# Altium project ATmega324PB_Xplained_Pro.PrjPCB (part 1 of 2)
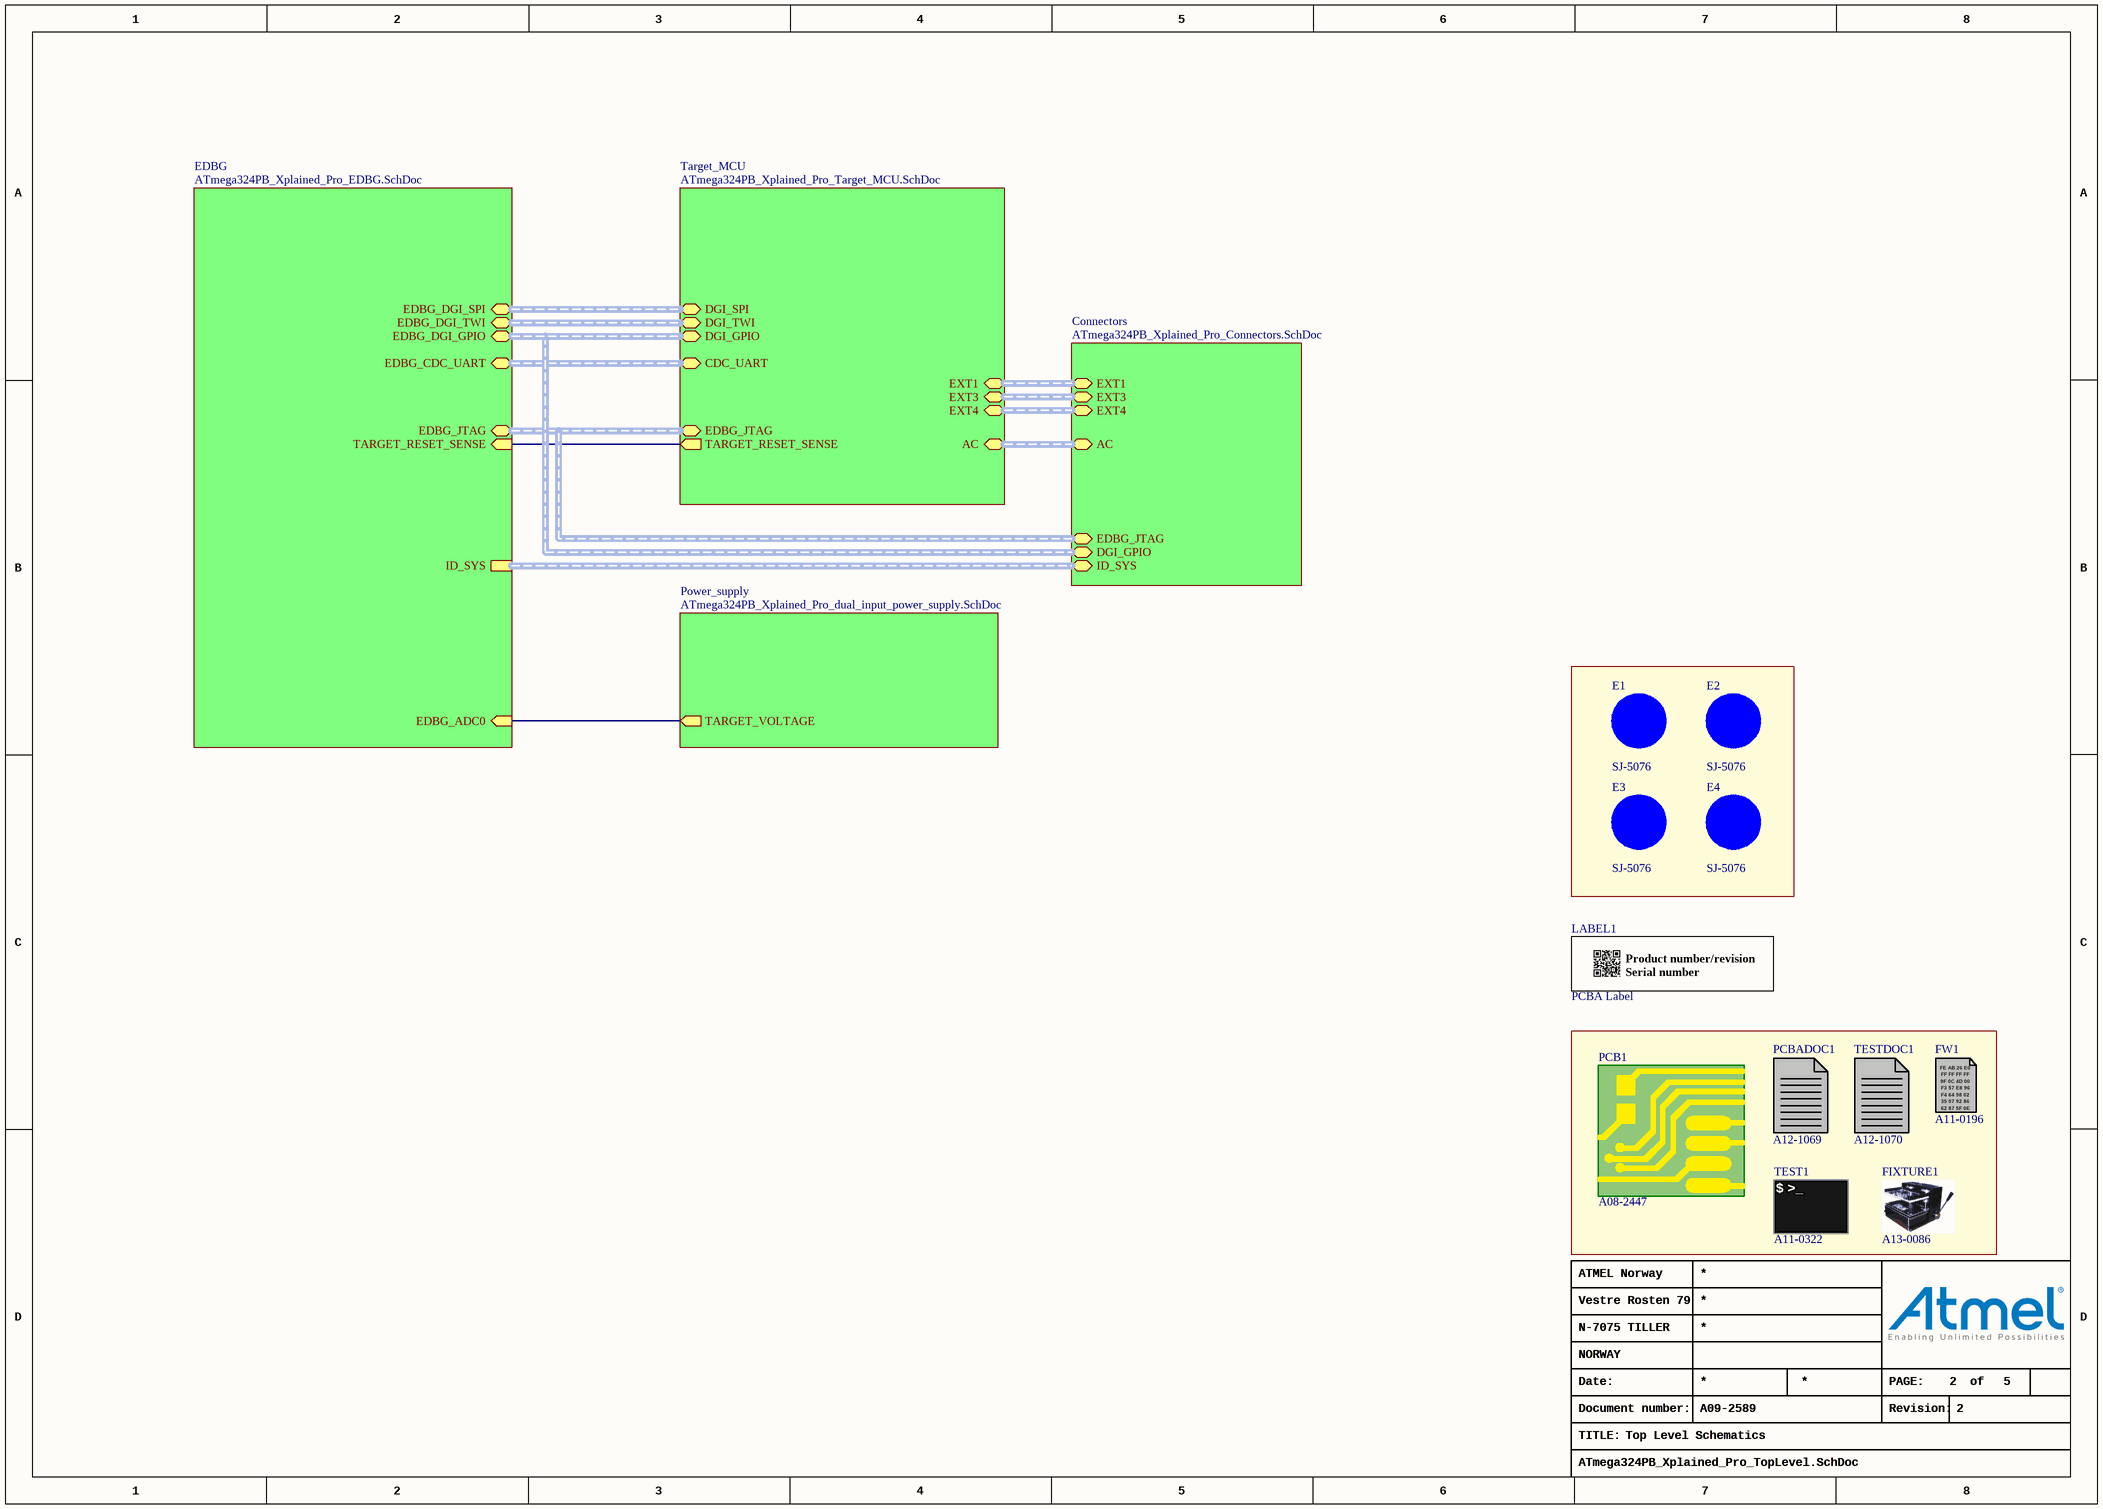
[diagram p0: ATmega324PB_Xplained_Pro_TopLevel.SchDoc]
5 sheets, 135 parts. Net scope: hierarchical (ports join the sheet entries above them; power ports are global).
Board file: ATmega324PB_Xplained_Pro.PcbDoc
Sheets:
  ATmega324PB_Xplained_Pro_TopLevel.SchDoc
    Target_MCU = ATmega324PB_Xplained_Pro_Target_MCU.SchDoc
    EDBG = ATmega324PB_Xplained_Pro_EDBG.SchDoc
    Connectors = ATmega324PB_Xplained_Pro_Connectors.SchDoc
    Power_supply = ATmega324PB_Xplained_Pro_dual_input_power_supply.SchDoc

## Sheet ATmega324PB_Xplained_Pro_TopLevel.SchDoc: Top Level Schematics
size A3; Organization: ATMEL Norway; Address1: Vestre Rosten 79; Address2: N-7075 TILLER; Address3: NORWAY; DocumentNumber: A09-2589; Revision: 2; SheetNumber: 2; SheetTotal: 5; PageSetup: Record=PageOptions|CenterHorizontal=True|CenterVertical=True|PrintScale=1.01|XCorrection=1.00|YCorrection=1.00|PrintKind=1|BorderSize=5000000|LeftOffset=0|BottomOffset=0|Orientation=2|PaperLength=1000|PaperWidth=1000|Scale=100|PaperSource=7|PrintQuality=-4|MediaType=1|DitherType=10|PaperKind=Letter|PrintScaleMode=1

### Parts
E1  value SJ-5076  [AP8-00192]
E2  value SJ-5076  [AP8-00192]
E3  value SJ-5076  [AP8-00192]
E4  value SJ-5076  [AP8-00192]
FIXTURE1  AN: A13-0086  (mechanical)
FW1  AN: A11-0196  (mechanical)
LABEL1  value PCBA Label  [AP8-00317]
PCB1  AN: A08-2447  (mechanical)
PCBADOC1  AN: A12-1069  (mechanical)
TEST1  AN: A11-0322  (mechanical)
TESTDOC1  AN: A12-1070  (mechanical)

### Sub-sheets
Connectors = ATmega324PB_Xplained_Pro_Connectors.SchDoc: ID_SYS (harness ID_SYS), EXT1 (harness EXT), EXT3 (harness EXT), EXT4 (harness EXT), DGI_GPIO (harness DGI_GPIO), AC (harness AC), EDBG_JTAG (harness JTAG)
EDBG = ATmega324PB_Xplained_Pro_EDBG.SchDoc: ID_SYS (harness ID_SYS), EDBG_CDC_UART (harness CDC_UART), EDBG_DGI_TWI (harness DGI_TWI), EDBG_DGI_SPI (harness DGI_SPI), EDBG_DGI_GPIO (harness DGI_GPIO), TARGET_RESET_SENSE (in), EDBG_ADC0 (in), EDBG_JTAG (harness JTAG)
Power_supply = ATmega324PB_Xplained_Pro_dual_input_power_supply.SchDoc: TARGET_VOLTAGE (out)
Target_MCU = ATmega324PB_Xplained_Pro_Target_MCU.SchDoc: DGI_SPI (harness DGI_SPI), DGI_TWI (harness DGI_TWI), DGI_GPIO (harness DGI_GPIO), CDC_UART (harness CDC_UART), TARGET_RESET_SENSE (out), EXT1 (harness EXT), EXT3 (harness EXT), EXT4 (harness EXT), AC (harness AC), EDBG_JTAG (harness JTAG)

### Nets
EDBG_ADC0: sheet EDBG/EDBG_ADC0, sheet Power_supply/TARGET_VOLTAGE
TARGET_RESET_SENSE: sheet Target_MCU/TARGET_RESET_SENSE, sheet EDBG/TARGET_RESET_SENSE

Not connected (* = marked no-connect by the designer): E1 1(FIDUCIAL); E2 1(FIDUCIAL); E3 1(FIDUCIAL); E4 1(FIDUCIAL)

### Buses and harness runs
harness sheet Connectors/AC = sheet Target_MCU/AC
harness sheet Connectors/DGI_GPIO = sheet EDBG/EDBG_DGI_GPIO = sheet Target_MCU/DGI_GPIO
harness sheet Connectors/EDBG_JTAG = sheet EDBG/EDBG_JTAG = sheet Target_MCU/EDBG_JTAG
harness sheet Connectors/EXT1 = sheet Target_MCU/EXT1
harness sheet Connectors/EXT3 = sheet Target_MCU/EXT3
harness sheet Connectors/EXT4 = sheet Target_MCU/EXT4
harness sheet Connectors/ID_SYS = sheet EDBG/ID_SYS
harness sheet EDBG/EDBG_CDC_UART = sheet Target_MCU/CDC_UART
harness sheet EDBG/EDBG_DGI_SPI = sheet Target_MCU/DGI_SPI
harness sheet EDBG/EDBG_DGI_TWI = sheet Target_MCU/DGI_TWI

### Notes on the sheet
- Date:
- PAGE:
- of
- TITLE:
- Document number:
- Revision:
- (in symbol A09-0611) / Product number/revision / Serial number
- (in symbol A11-0196) FE AB 26 E0; FF FF FF FF; 9F 0C 4D 00; F3 57 E8 96; F4 64 98 02; 35 07 92 86; 62 87 5F 0E
- (in symbol A11-0322) $ >_

### Library data of the parts
E1-E4 = A08-0053: 2.8mm adhesive feet,diam 8.0mm; PartGroup: Mechanical devices,Mounting accessories; Manufacturer: 3M; AN: A08-0053; Height: 2,79999995231628; MPN: SJ-5076
FIXTURE1 = A13-0086: Xplained PRO MCU board Jupiter Test Fixture; PartGroup: Test Equipment,Test Fixtures; Manufacturer: ESCATEC; Value: Xplained PRO MCU board Jupiter Test Fixture; MPN: Xplained PRO MCU board Jupiter Test Fixture
FW1 = A11-0196: EDBG secured firmware; PartGroup: Software,Firmware,Tools; Value: EDBG secured firmware
LABEL1 = A09-0611: PCBA identification label PP Top White Gloss; PartGroup: Mechanical devices,Packaging materials,Printed Labels; Manufacturer: ACT Logimark AS; MPN: 505462; AN: A09-0611
PCB1 = A08-2447: ATmega324PB_Xplained_Pro PCB documentation; PartGroup: Mechanical devices; Value: ATmega324PB_Xplained_Pro PCB documentation
PCBADOC1 = A12-1069: ATmega324PB Xplained Pro PCBA documentation; PartGroup: Documentation,PCBA Documents,Atmel; Value: A09-2589 PCBA Files
TEST1 = A11-0322: Fixture test for ATmega324PB Xplained Pro; PartGroup: Software,Test software,Starter Kit; Value: ATmega324PB Xplained Pro test
TESTDOC1 = A12-1070: ATmega324PB Xplained Pro Test Instructions; PartGroup: Documentation,Procedures,Test Instructions; Value: ATmega324PB Xplained Pro Test Instructions

## Sheet ATmega324PB_Xplained_Pro_Target_MCU.SchDoc: Target MCU
size A3; Organization: ATMEL Norway; Address1: Vestre Rosten 79; Address2: N-7075 TILLER; Address3: NORWAY; DocumentNumber: A09-2589; Revision: 2; SheetNumber: 3; SheetTotal: 5; PageSetup: Record=PageOptions|CenterHorizontal=True|CenterVertical=True|PrintScale=1.01|XCorrection=1.00|YCorrection=1.00|PrintKind=1|BorderSize=5000000|LeftOffset=0|BottomOffset=0|Orientation=2|PaperLength=1000|PaperWidth=1000|Scale=100|PaperSource=7|PrintQuality=-4|MediaType=1|DitherType=10|PaperKind=A3 (297 x 420 mm)|PrintScaleMode=1
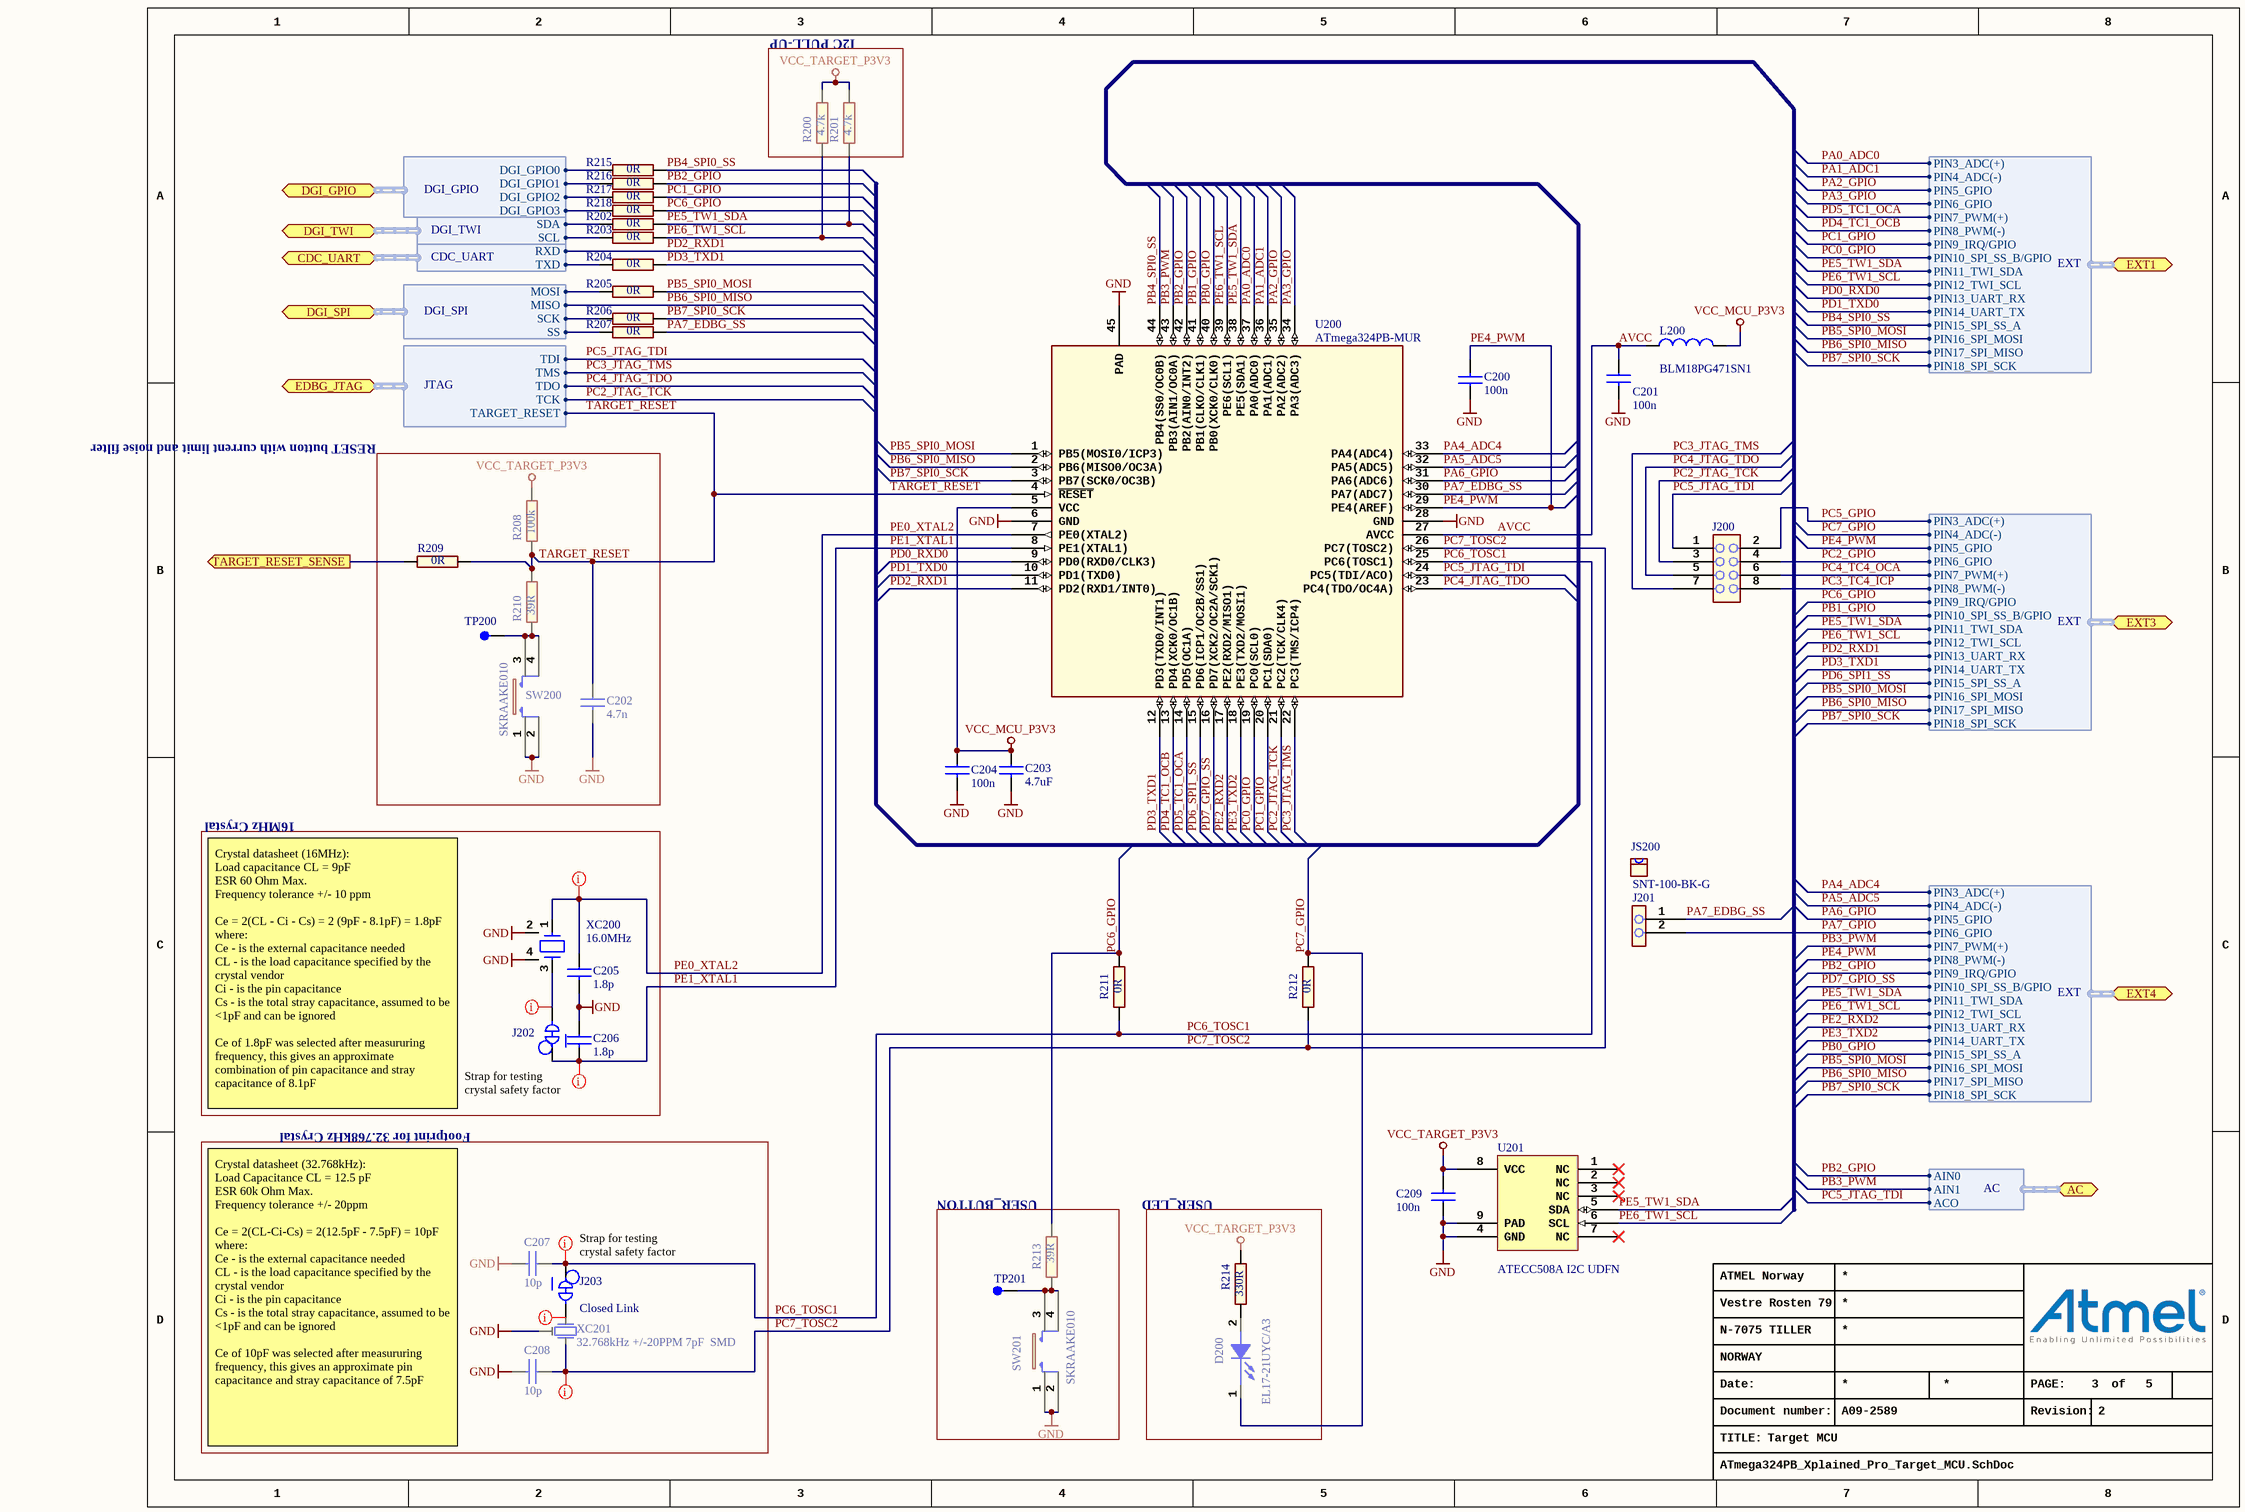
[diagram p1: ATmega324PB_Xplained_Pro_Target_MCU.SchDoc]

### Parts
C200  value 100n  [AP1-00001]
C201  value 100n  [AP1-00001]
C202  value 4.7n  [AP1-00053]
C203  value 4.7uF  [AP1-00039]
C204  value 100n  [AP1-00001]
C205  value 1.8p  [AP1-00001]
C206  value 1.8p  [AP1-00001]
C207  value 10p  [AP1-00001]
C208  value 10p  [AP1-00001]
C209  value 100n  [AP1-00001]
D200  value EL17-21UYC/A3  [AP4-00013]
J200  (no value)  [AP8-00971]
J201  (no value)  [AP8-00733]
J202  (no value)  [AP8-00595]  (net tie, no BOM)
J203  value Closed Link  [AP8-00595]  (net tie, no BOM)
JS200  value SNT-100-BK-G  [AP8-00525]
L200  value BLM18PG471SN1  [AP3-00005]
R200  value 4.7k  [AP2-00000]
R201  value 4.7k  [AP2-00000]
R202  value 0R  [AP2-00000]
R203  value 0R  [AP2-00000]
R204  value 0R  [AP2-00000]
R205  value 0R  [AP2-00000]
R206  value 0R  [AP2-00000]
R207  value 0R  [AP2-00000]
R208  value 100k  [AP2-00011]
R209  value 0R  [AP2-00000]
R210  value 39R  [AP2-00011]
R211  value 0R  [AP2-00000]
R212  value 0R  [AP2-00000]
R213  value 39R  [AP2-00011]
R214  value 330R  [AP2-00000]
R215  value 0R  [AP2-00000]
R216  value 0R  [AP2-00000]
R217  value 0R  [AP2-00000]
R218  value 0R  [AP2-00000]
SW200  value SKRAAKE010  [AP8-00137]  (hidden comment: Can be ordered in low volumes from Mouser)
SW201  value SKRAAKE010  [AP8-00137]  (hidden comment: Can be ordered in low volumes from Mouser)
TP200  (no value)  [AP8-00010]  (no BOM)
TP201  (no value)  [AP8-00010]  (no BOM)
U200  value ATmega324PB-MUR  [AP6-00147]  (hidden comment: Footprint has tight silkscreen to solder mask expansion clearance)
U201  value ATECC508A I2C UDFN  [AP6-00409]
XC200  value 16.0MHz  [AP7-00061]
XC201  value 32.768kHz +/-20PPM 7pF  SMD  [AP7-00044]  (hidden comment: Farnell order no:1539364)

### Blocks framed on the sheet
I2C PULL-UP: R200 R201
RESET button with current limit and noise filter: C202 R208-R210 SW200 TP200
16MHz Crystal: C205 C206 J202 XC200
Footprint for 32.768kHz Crystal: C207 C208 J203 XC201
USER_BUTTON: R213 SW201 TP201
USER_LED: D200 R214

### Ports
AC (harness AC), CDC_UART (harness CDC_UART), DGI_GPIO (harness DGI_GPIO), DGI_SPI (harness DGI_SPI), DGI_TWI (harness DGI_TWI), EDBG_JTAG (harness JTAG), EXT1 (harness EXT), EXT3 (harness EXT), EXT4 (harness EXT), TARGET_RESET_SENSE (out)

### Harnesses
DGI_GPIO: DGI_GPIO0, DGI_GPIO1, DGI_GPIO2, DGI_GPIO3
DGI_SPI: MISO, MOSI, SCK, SS
DGI_TWI: SCL, SDA
CDC_UART: RXD, TXD
EXT: PIN10_SPI_SS_B/GPIO, PIN11_TWI_SDA, PIN12_TWI_SCL, PIN13_UART_RX, PIN14_UART_TX, PIN15_SPI_SS_A, PIN16_SPI_MOSI, PIN17_SPI_MISO, PIN18_SPI_SCK, PIN3_ADC(+), PIN4_ADC(-), PIN5_GPIO, PIN6_GPIO, PIN7_PWM(+), PIN8_PWM(-), PIN9_IRQ/GPIO
JTAG: TCK, TDI, TDO, TMS, TARGET_RESET
AC: AIN1, AIN0, ACO

### Nets
GND: C200.1 C201.2 C202.2 C203.2 C204.2 C205.2 C206.1 C207.2 C208.2 C209.1 SW200.1 SW200.2 SW201.1 SW201.2 U200.6(GND) U200.28(GND) U200.45(PAD) U201.4(GND) U201.9(PAD) XC200.2(GND) XC200.4(GND) XC201.3
VCC_MCU_P3V3: C203.1 C204.1 L200.2 U200.5(VCC)
VCC_TARGET_P3V3: C209.2 R200.2 R201.2 R208.2 R214.2 U201.8(VCC)
AVCC: C201.1 L200.1 U200.27(AVCC)
DGI_GPIO0_CL: R215.1 ; port DGI_GPIO.DGI_GPIO0
DGI_GPIO1_CL: R216.1 ; port DGI_GPIO.DGI_GPIO1
DGI_GPIO2_CL: R217.1 ; port DGI_GPIO.DGI_GPIO2
DGI_GPIO3_CL: R218.1 ; port DGI_GPIO.DGI_GPIO3
EDBG_CDC_USART_RX: R204.1 ; port CDC_UART.TXD
EDBG_DGI_SCL: R203.1 ; port DGI_TWI.SCL
EDBG_DGI_SDA: R202.1 ; port DGI_TWI.SDA
EDBG_SPI_DGI_MOSI: R205.1 ; port DGI_SPI.MOSI
EDBG_SPI_DGI_SCK: R206.1 ; port DGI_SPI.SCK
EDBG_SPI_DGI_SS: R207.1 ; port DGI_SPI.SS
PA0_ADC0: U200.37(PA0(ADC0)) ; port EXT1.PIN3_ADC(+)
PA1_ADC1: U200.36(PA1(ADC1)) ; port EXT1.PIN4_ADC(-)
PA2_GPIO: U200.35(PA2(ADC2)) ; port EXT1.PIN5_GPIO
PA3_GPIO: U200.34(PA3(ADC3)) ; port EXT1.PIN6_GPIO
PA4_ADC4: U200.33(PA4(ADC4)) ; port EXT4.PIN3_ADC(+)
PA5_ADC5: U200.32(PA5(ADC5)) ; port EXT4.PIN4_ADC(-)
PA6_GPIO: U200.31(PA6(ADC6)) ; port EXT4.PIN5_GPIO
PA7_EDBG_SS: J201.1 R207.2 U200.30(PA7(ADC7))
PA7_GPIO: J201.2 ; port EXT4.PIN6_GPIO
PB0_GPIO: U200.40(PB0(XCK0/CLK0)) ; port EXT4.PIN15_SPI_SS_A
PB1_GPIO: U200.41(PB1(CLKO/CLK1)) ; port EXT3.PIN10_SPI_SS_B/GPIO
PB2_GPIO: R216.2 U200.42(PB2(AIN0/INT2)) ; port EXT4.PIN9_IRQ/GPIO, port AC.AIN0
PB3_PWM: U200.43(PB3(AIN1/OC0A)) ; port EXT4.PIN7_PWM(+), port AC.AIN1
PB4_SPI0_SS: R215.2 U200.44(PB4(SS0/OC0B)) ; port EXT1.PIN15_SPI_SS_A
PB5_SPI0_MOSI: R205.2 U200.1(PB5(MOSI0/ICP3)) ; port EXT1.PIN16_SPI_MOSI, port EXT4.PIN16_SPI_MOSI, port EXT3.PIN16_SPI_MOSI
PB6_SPI0_MISO: U200.2(PB6(MISO0/OC3A)) ; port DGI_SPI.MISO, port EXT1.PIN17_SPI_MISO, port EXT4.PIN17_SPI_MISO, port EXT3.PIN17_SPI_MISO
PB7_SPI0_SCK: R206.2 U200.3(PB7(SCK0/OC3B)) ; port EXT1.PIN18_SPI_SCK, port EXT4.PIN18_SPI_SCK, port EXT3.PIN18_SPI_SCK
PC0_GPIO: U200.19(PC0(SCL0)) ; port EXT1.PIN10_SPI_SS_B/GPIO
PC1_GPIO: R217.2 U200.20(PC1(SDA0)) ; port EXT1.PIN9_IRQ/GPIO
PC2_GPIO: J200.4 ; port EXT3.PIN6_GPIO
PC2_JTAG_TCK: J200.3 U200.21(PC2(TCK/CLK4)) ; port EDBG_JTAG.TCK
PC3_JTAG_TMS: J200.7 U200.22(PC3(TMS/ICP4)) ; port EDBG_JTAG.TMS
PC3_TC4_ICP: J200.8 ; port EXT3.PIN8_PWM(-)
PC4_JTAG_TDO: J200.5 U200.23(PC4(TDO/OC4A)) ; port EDBG_JTAG.TDO
PC4_TC4_OCA: J200.6 ; port EXT3.PIN7_PWM(+)
PC5_GPIO: J200.2 ; port EXT3.PIN3_ADC(+)
PC5_JTAG_TDI: J200.1 U200.24(PC5(TDI/ACO)) ; port EDBG_JTAG.TDI, port AC.ACO
PC6_GPIO: R211.2 R213.2 R218.2 ; port EXT3.PIN9_IRQ/GPIO
PC6_TOSC1: C207.1 J203.1 R211.1 U200.25(PC6(TOSC1))
PC7_GPIO: D200.1(CATHODE) R212.2 ; port EXT3.PIN4_ADC(-)
PC7_TOSC2: C208.1 R212.1 U200.26(PC7(TOSC2)) XC201.1
PD0_RXD0: U200.9(PD0(RXD0/CLK3)) ; port EXT1.PIN13_UART_RX
PD1_TXD0: U200.10(PD1(TXD0)) ; port EXT1.PIN14_UART_TX
PD2_RXD1: U200.11(PD2(RXD1/INT0)) ; port CDC_UART.RXD, port EXT3.PIN13_UART_RX
PD3_TXD1: R204.2 U200.12(PD3(TXD0/INT1)) ; port EXT3.PIN14_UART_TX
PD4_TC1_OCB: U200.13(PD4(XCK0/OC1B)) ; port EXT1.PIN8_PWM(-)
PD5_TC1_OCA: U200.14(PD5(OC1A)) ; port EXT1.PIN7_PWM(+)
PD6_SPI1_SS: U200.15(PD6(ICP1/OC2B/SS1)) ; port EXT3.PIN15_SPI_SS_A
PD7_GPIO_SS: U200.16(PD7(XCK2/OC2A/SCK1)) ; port EXT4.PIN10_SPI_SS_B/GPIO
PE0_XTAL2: C205.1 U200.7(PE0(XTAL2)) XC200.1(IN)
PE1_XTAL1: C206.2 J202.1 U200.8(PE1(XTAL1))
PE2_RXD2: U200.17(PE2(RXD2/MISO1)) ; port EXT4.PIN13_UART_RX
PE3_TXD2: U200.18(PE3(TXD2/MOSI1)) ; port EXT4.PIN14_UART_TX
PE4_PWM: C200.2 U200.29(PE4(AREF)) ; port EXT4.PIN8_PWM(-), port EXT3.PIN5_GPIO
PE5_TW1_SDA: R201.1 R202.2 U200.38(PE5(SDA1)) U201.5(SDA) ; port EXT1.PIN11_TWI_SDA, port EXT4.PIN11_TWI_SDA, port EXT3.PIN11_TWI_SDA
PE6_TW1_SCL: R200.1 R203.2 U200.39(PE6(SCL1)) U201.6(SCL) ; port EXT1.PIN12_TWI_SCL, port EXT4.PIN12_TWI_SCL, port EXT3.PIN12_TWI_SCL
TARGET_RESET: C202.1 R208.1 R209.2 R210.2 U200.4(~{RESET}) ; port EDBG_JTAG.TARGET_RESET
TARGET_RESET_SENSE: R209.1 ; port TARGET_RESET_SENSE
NetD200_2: D200.2(ANODE) R214.1
NetJ202_2: J202.2 XC200.3(OUT)
NetJ203_2: J203.2 XC201.2
NetR210_1: R210.1 SW200.3 SW200.4 TP200.1
NetR213_1: R213.1 SW201.3 SW201.4 TP201.1

Not connected (* = marked no-connect by the designer): U201 1(NC)* 2(NC)* 3(NC)* 7(NC)*

### Layout directives
rule Assembly Testpoint Usage [Testpoint - Not Allowed    Multiple - Not Allowed]: NetJ202_2, NetJ203_2, PC6_TOSC1, PC7_TOSC2, PE0_XTAL2, PE1_XTAL1

### Notes on the sheet
- Crystal datasheet (16MHz):
  Load capacitance CL = 9pF
  ESR 60 Ohm Max.
  Frequency tolerance +/- 10 ppm
  Ce = 2(CL - Ci - Cs) = 2 (9pF - 8.1pF) = 1.8pF
  where:
  Ce - is the external capacitance needed
  CL - is the load capacitance specified by the crystal vendor
  Ci - is the pin capacitance
  Cs - is the total stray capacitance, assumed to be <1pF and can be ignored
  Ce of 1.8pF was selected after measururing frequency, this gives an approximate combination of pin capacitance and stray capacitance of 8.1pF
- Strap for testing crystal safety factor
- (near J203) Strap for testing crystal safety factor
- Crystal datasheet (32.768kHz):
  Load Capacitance CL = 12.5 pF
  ESR 60k Ohm Max.
  Frequency tolerance +/- 20ppm
  Ce = 2(CL-Ci-Cs) = 2(12.5pF - 7.5pF) = 10pF
  where:
  Ce - is the external capacitance needed
  CL - is the load capacitance specified by the crystal vendor
  Ci - is the pin capacitance
  Cs - is the total stray capacitance, assumed to be <1pF and can be ignored
  Ce of 10pF was selected after measururing frequency, this gives an approximate pin capacitance and stray capacitance of 7.5pF
- Date:
- PAGE:
- of
- TITLE:
- Document number:
- Revision:

### Library data of the parts
C200 C201 C204 C209 = A01-0246: Ceramic capacitor, SMD 0402, X7R, 16V, +/-10%; PartGroup: Capacitors,Ceramic,SMD 0402; Manufacturer: Kemet; MPN: C0402C104K4RACTU; TemperatureRange: -55 - +125 deg C; AN: A01-0246; Tolerance: 16V, +/-10%; Height: 0,5
C202 = A01-0046: Ceramic capacitor, SMD 0402, X7R, 25V, +/-10% (de35287); PartGroup: Capacitors,Ceramic,SMD 0402; TemperatureRange: -55 - +125 deg C; AN: A01-0046; Height: 0,550000011920929; Tolerance: 25V, +/-10%
C203 = A01-0377: Ceramic capacitor, SMD 0603, X5R, 10V, 10% (de31036); PartGroup: Capacitors,Ceramic,SMD 0603; Manufacturer: tdk; MPN: C1608X5R1A475K; TemperatureRange: -55 - +85 deg C; AN: A01-0377; Tolerance: 10%; Height: 0,800000011920929
C205 C206 = A01-0006: Ceramic capacitor, SMD 0402, NP0, 50V, +/-0.25pF; PartGroup: Capacitors,Ceramic,SMD 0402; TemperatureRange: -55 - +125 deg C; AN: A01-0006; Tolerance: 50V, +/-0.25pF; Height: 0,550000011920929
C207 C208 = A01-0015: Ceramic capacitor, SMD 0402, NP0, 50V, +/-5%; PartGroup: Capacitors,Ceramic,SMD 0402; TemperatureRange: -55 - +125 deg C; AN: A01-0015; Tolerance: 50V, +/-5%; Height: 0,550000011920929
D200 = A10-0019: LED, Yellow, Wave length=591nm, SMD 0805, ±70°; PartGroup: Opto,LEDs,SMD; Manufacturer: Everlight; MPN: 17-21UYC/S530-A3/TR8; TemperatureRange: -40 to +85 deg C; AN: A10-0019; Height: 1,10000002384186
J200 = A08-2452: 2x4 pin header, 2.54 mm pitch, Pin-in-Paste THM; PartGroup: Mechanical devices,Connectors,Pin headers; Manufacturer: SAMTEC; Value: HMTSW-104-23-F-D-237; TemperatureRange: - 55 C to + 125 C; AN: A08-2452; Height: 6,09999990463257; MPN: HMTSW-104-23-F-D-237
J201 = A08-1754: 1x2 pin header, 2.54mm pitch, Pin-in-Paste THM; PartGroup: Mechanical devices,Connectors,Pin headers; Manufacturer: SAMTEC; Value: HMTSW-102-23-F-S-237; TemperatureRange: - 55 deg C to + 125 deg C; AN: A08-1754; Height: 6,09999990463257; MPN: HMTSW-102-23-F-S-237
J202 J203 = A08-1454: Closed Link 0402; PartGroup: Mechanical devices,PCB implemented components; AN: A08-1454
  J202: Value: Closed Link
JS200 = A08-0543: Jumper cap for 2.54mm pinheader; PartGroup: Mechanical devices,Mounting accessories,Other; Manufacturer: SAMTEC; AN: A08-0543; MPN: SNT-100-BK-G
L200 = A03-0035: SMD RF inductor 0603. Z=470Ohm (@100MHz), Max R(dc)=0.65Ohm, Max current=1A; PartGroup: Inductors,EMI; Manufacturer: Murata; Tolerance: ±25%; TemperatureRange: -55°C to +125°C; AN: A03-0035; Height: 0,800000011920929; MPN: BLM18PG471SN1
R200 R201 = A02-0228: Thick film resistor, SMD 0402, 1/16W, 1%; PartGroup: Resistors,SMD,0402 1%; TemperatureRange: -55ï¿½ to +125ï¿½C; AN: A02-0228; Tolerance: 1 %; Height: 0,349999994039536
R202-R207 R209 R211 R212 R215-R218 = A02-0163: RES 0.0 OHM 1/16W 0402 SMD; PartGroup: Resistors,SMD,0402 1%; Manufacturer: (n/a); MPN: RMCF0402ZT0R00; Tolerance: 1 %; TemperatureRange: -55 - +125 deg C; AN: A02-0163; Height: 0,349999994039536
R208 = A02-0260: Thick film resistor, SMD 0402, 1/16W, 1%; PartGroup: Resistors,SMD,0402 1%; TemperatureRange: -55ï¿½ to +125ï¿½C; AN: A02-0260; Tolerance: 1 %; Height: 0,349999994039536
R210 R213 = A02-0178: Thick film resistor, SMD 0402, 1/16W, 1%; PartGroup: Resistors,SMD,0402 1%; TemperatureRange: -55 - +125 deg C; AN: A02-0178; Tolerance: 1 %; Height: 0,349999994039536
R214 = A02-0200: Thick film resistor, SMD 0402, 1/16W, 1%; PartGroup: Resistors,SMD,0402 1%; TemperatureRange: -55 - +125 deg C; AN: A02-0200; Tolerance: 1 %; Height: 0,349999994039536
SW200 SW201 = A08-0790: 6.2x6.2 mm SMD tact switch, same as A08-0091 but less force is needed; PartGroup: Mechanical devices,Switches,SMD; Manufacturer: ALPS; TemperatureRange: -30 - +90 deg C; AN: A08-0790; Height: 5,09999990463257; MPN: SKRAAKE010
TP200 TP201 = A08-0004: Single SMD testpad; PartGroup: Mechanical devices,Connectors,Test points; AN: A08-0004; Value: TESTPAD; Height: 0
U200 = A06-1345: AVR 8-bit RISC MCU; PartGroup: Integrated Circuits,MCU, MPU, DSP,AVR MCU; Manufacturer: ATMEL; AN: A06-1345; MPN: ATmega324PB-MUR
U201 = A06-1281: ATECC508A with an I2C Interface and a 8 Pin UDFN Package with Paddle; PartGroup: Integrated Circuits,Special function,Encryption; Manufacturer: ATMEL; MPN: ATECC508A-MAHDA-T; AN: A06-1281; Height: 0,600000023841858
XC200 = A07-0078: 16MHz uXtal, 3.2 x 2.5 mm SMD, CL=9pF, 15PPM, ESR=80ohm(Max.; PartGroup: Frequency devices,Crystals,SMD; Manufacturer: Epson Toyocom; MPN: TSX-3225 16.0000MF09Z-AC3; TemperatureRange: -40Â°C to +85Â°C; AN: A07-0078; Tolerance: 15ppm; Height: 0,699999988079071
XC201 = A07-0052: 32k768 crystal, +-20ppm, CL=7pF, max ESR 60kOhm, SMD; PartGroup: Frequency devices,Crystals,SMD; Manufacturer: Micro Crystal; MPN: MS1V-T1K 32.768kHz 7pF +/-20PPM TA; Tolerance: +/- 20 PPM; TemperatureRange: -40 /+85; AN: A07-0052; Height: 2,07999992370605

## Sheet ATmega324PB_Xplained_Pro_EDBG.SchDoc: Embedded Debugger (EDBG)
size A3; Organization: ATMEL Norway; Address1: Vestre Rosten 79; Address2: N-7075 TILLER; Address3: NORWAY; DocumentNumber: A09-2589; Revision: 2; SheetNumber: 5; SheetTotal: 5; PageSetup: Record=PageOptions|CenterHorizontal=True|CenterVertical=True|PrintScale=0.73|XCorrection=1.00|YCorrection=1.00|PrintKind=1|BorderSize=5000000|LeftOffset=0|BottomOffset=0|Orientation=2|PaperLength=1000|PaperWidth=1000|Scale=100|PaperSource=7|PrintQuality=-4|MediaType=1|DitherType=10|PaperKind=A3 (297 x 420 mm)|PrintScaleMode=1
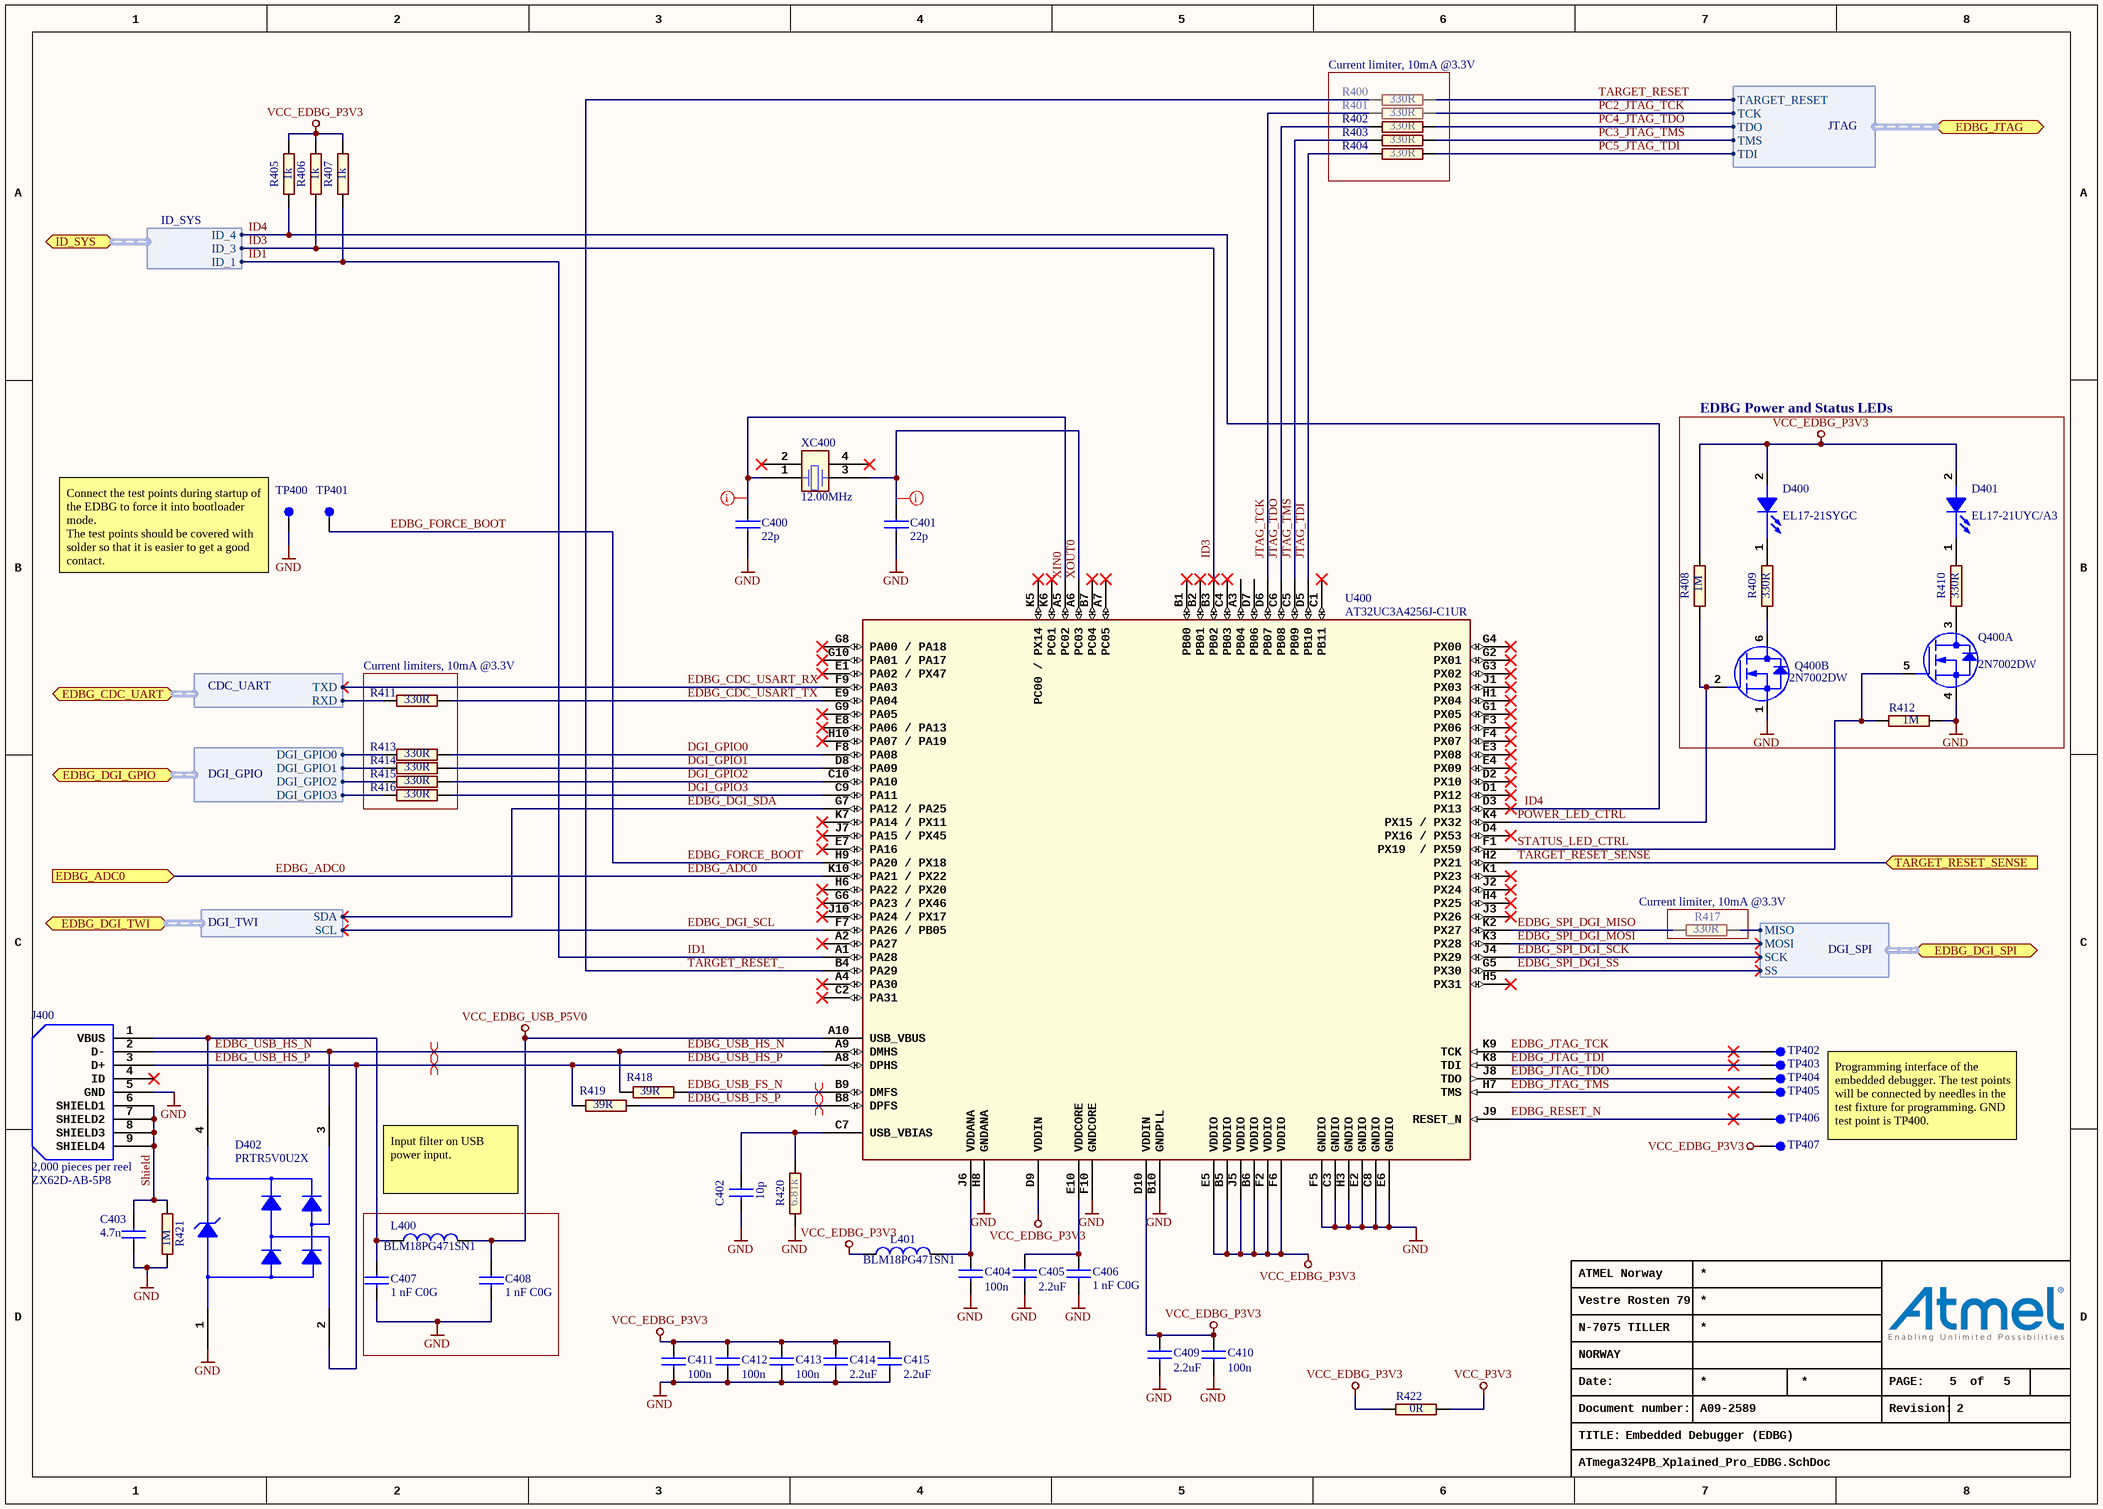
[diagram p2: ATmega324PB_Xplained_Pro_EDBG.SchDoc]

### Parts
C400  value 22p  [AP1-00053]
C401  value 22p  [AP1-00053]
C402  value 10p  [AP1-00053]
C403  value 4.7n  [AP1-00053]
C404  value 100n  [AP1-00053]
C405  value 2.2uF  [AP1-00053]  (hidden comment: Farnell no: 1288200)
C406  value 1 nF C0G  [AP1-00053]
C407  value 1 nF C0G  [AP1-00053]
C408  value 1 nF C0G  [AP1-00053]
C409  value 2.2uF  [AP1-00053]  (hidden comment: Farnell no: 1288200)
C410  value 100n  [AP1-00053]
C411  value 100n  [AP1-00053]
C412  value 100n  [AP1-00053]
C413  value 100n  [AP1-00053]
C414  value 2.2uF  [AP1-00053]  (hidden comment: Farnell no: 1288200)
C415  value 2.2uF  [AP1-00053]  (hidden comment: Farnell no: 1288200)
D400  value EL17-21SYGC  [AP4-00013]
D401  value EL17-21UYC/A3  [AP4-00013]
D402  value PRTR5V0U2X  [AP4-00001]  (hidden comment: Changed manufacturer from Philips to NXP.)
J400  2,000 pieces per reel  value ZX62D-AB-5P8  [AP8-00852]
L400  value BLM18PG471SN1  [AP3-00005]
L401  value BLM18PG471SN1  [AP3-00005]
Q400  value 2N7002DW  [AP5-00001]  (hidden comment: Same as 2N7002 but with two MOSFETs in one package)  (parts A,B of 2)
R400  value 330R  [AP2-00000]
R401  value 330R  [AP2-00000]
R402  value 330R  [AP2-00000]
R403  value 330R  [AP2-00000]
R404  value 330R  [AP2-00000]
R405  value 1k  [AP2-00000]
R406  value 1k  [AP2-00000]
R407  value 1k  [AP2-00000]
R408  value 1M  [AP2-00000]
R409  value 330R  [AP2-00000]
R410  value 330R  [AP2-00000]
R411  value 330R  [AP2-00000]
R412  value 1M  [AP2-00000]
R413  value 330R  [AP2-00000]
R414  value 330R  [AP2-00000]
R415  value 330R  [AP2-00000]
R416  value 330R  [AP2-00000]
R417  value 330R  [AP2-00000]
R418  value 39R  [AP2-00011]
R419  value 39R  [AP2-00011]
R420  value 6.81k  [AP2-00011]
R421  value 1M  [AP2-00011]
R422  value 0R  [AP2-00000]
TP400  (no value)  [AP8-00010]  (no BOM)
TP401  (no value)  [AP8-00010]  (no BOM)
TP402  (no value)  [AP8-00010]  (no BOM)
TP403  (no value)  [AP8-00010]  (no BOM)
TP404  (no value)  [AP8-00010]  (no BOM)
TP405  (no value)  [AP8-00010]  (no BOM)
TP406  (no value)  [AP8-00010]  (no BOM)
TP407  (no value)  [AP8-00010]  (no BOM)
U400  value AT32UC3A4256J-C1UR  [AP6-00206]  (hidden comment: 100 ball VFBGA)
XC400  value 12.00MHz  [AP7-00039]

### Blocks framed on the sheet
Current limiter, 10mA @3.3V: R400-R404
EDBG Power and Status LEDs: D400 D401 Q400 R408-R410 R412
Current limiters, 10mA @3.3V: R411 R413-R416

### Ports
EDBG_ADC0 (in), EDBG_CDC_UART (harness CDC_UART), EDBG_DGI_GPIO (harness DGI_GPIO), EDBG_DGI_SPI (harness DGI_SPI), EDBG_DGI_TWI (harness DGI_TWI), EDBG_JTAG (harness JTAG), ID_SYS (harness ID_SYS), TARGET_RESET_SENSE (in)

### Harnesses
CDC_UART: TXD, RXD
DGI_SPI: MISO, MOSI, SCK, SS
DGI_GPIO: DGI_GPIO0, DGI_GPIO1, DGI_GPIO2, DGI_GPIO3
DGI_TWI: SCL, SDA
JTAG: TCK, TDI, TDO, TMS, TARGET_RESET
ID_SYS: ID_1, ID_3, ID_4

### Nets
GND: C400.2 C401.2 C402.2 C403.1 C404.2 C405.2 C406.2 C407.2 C408.2 C409.2 C410.2 C411.2 C412.2 C413.2 C414.2 C415.2 D402.1(GND) J400.5(GND) Q400.1(S2) Q400.4(S1) R412.1 R420.1 R421.1 TP400.1 U400.B10(GNDPLL) U400.C3(GNDIO) U400.C8(GNDIO) U400.E2(GNDIO) U400.E6(GNDIO) U400.F5(GNDIO) U400.F10(GNDCORE) U400.H3(GNDIO) U400.H8(GNDANA)
VCC_EDBG_P3V3: C409.1 C410.1 C411.1 C412.1 C413.1 C414.1 C415.1 D400.2(ANODE) D401.2(ANODE) L401.1 R405.2 R406.2 R407.2 R408.2 R422.1 TP407.1 U400.B5(VDDIO) U400.B6(VDDIO) U400.D9(VDDIN) U400.D10(VDDIN) U400.E5(VDDIO) U400.F2(VDDIO) U400.F6(VDDIO) U400.J5(VDDIO)
VCC_EDBG_USB_P5V0: C408.1 L400.2 U400.A10(USB_VBUS)
VCC_P3V3: R422.2
DGI_GPIO0: R413.2 U400.F8(PA08)
DGI_GPIO0_CL: R413.1 ; port EDBG_DGI_GPIO.DGI_GPIO0
DGI_GPIO1: R414.2 U400.D8(PA09)
DGI_GPIO1_CL: R414.1 ; port EDBG_DGI_GPIO.DGI_GPIO1
DGI_GPIO2: R415.2 U400.C10(PA10)
DGI_GPIO2_CL: R415.1 ; port EDBG_DGI_GPIO.DGI_GPIO2
DGI_GPIO3: R416.2 U400.C9(PA11)
DGI_GPIO3_CL: R416.1 ; port EDBG_DGI_GPIO.DGI_GPIO3
EDBG_ADC0: U400.K10(PA21_/_PX22) ; port EDBG_ADC0
EDBG_CDC_USART_RX: U400.F9(PA03) ; port EDBG_CDC_UART.TXD
EDBG_CDC_USART_TX: R411.2 U400.E9(PA04)
EDBG_DGI_SCL: U400.F7(PA26_/_PB05) ; port EDBG_DGI_TWI.SCL
EDBG_DGI_SDA: U400.G7(PA12_/_PA25) ; port EDBG_DGI_TWI.SDA
EDBG_FORCE_BOOT: TP401.1 U400.H9(PA20_/_PX18)
EDBG_JTAG_TCK: TP402.1 U400.K9(TCK)
EDBG_JTAG_TDI: TP403.1 U400.K8(TDI)
EDBG_JTAG_TDO: TP404.1 U400.J8(TDO)
EDBG_JTAG_TMS: TP405.1 U400.H7(TMS)
EDBG_RESET_N: TP406.1 U400.J9(RESET_N)
EDBG_SPI_DGI_MISO: R417.1 U400.K2(PX27)
EDBG_SPI_DGI_MOSI: U400.K3(PX28) ; port EDBG_DGI_SPI.MOSI
EDBG_SPI_DGI_SCK: U400.J4(PX29) ; port EDBG_DGI_SPI.SCK
EDBG_SPI_DGI_SS: U400.G5(PX30) ; port EDBG_DGI_SPI.SS
EDBG_USB_FS_N: R418.2 U400.B9(DMFS)
EDBG_USB_FS_P: R419.2 U400.B8(DPFS)
EDBG_USB_HS_N: D402.3(I/O_2) J400.2(D-) R418.1 U400.A9(DMHS)
EDBG_USB_HS_P: D402.2(I/O_1) J400.3(D+) R419.1 U400.A8(DPHS)
ID1: R407.1 U400.A1(PA28) ; port ID_SYS.ID_1
ID3: R406.1 U400.B3(PB02) ; port ID_SYS.ID_3
ID4: R405.1 U400.D3(PX13) ; port ID_SYS.ID_4
JTAG_TCK: R401.1 U400.D6(PB07)
JTAG_TDI: R404.1 U400.D5(PB10)
JTAG_TDO: R402.1 U400.C6(PB08)
JTAG_TMS: R403.1 U400.C5(PB09)
PB6_SPI0_MISO: R417.2 ; port EDBG_DGI_SPI.MISO
PC2_JTAG_TCK: R401.2 ; port EDBG_JTAG.TCK
PC3_JTAG_TMS: R403.2 ; port EDBG_JTAG.TMS
PC4_JTAG_TDO: R402.2 ; port EDBG_JTAG.TDO
PC5_JTAG_TDI: R404.2 ; port EDBG_JTAG.TDI
PD2_RXD1: R411.1 ; port EDBG_CDC_UART.RXD
POWER_LED_CTRL: Q400.2(G2) R408.1 U400.K4(PX15_/_PX32)
Shield: C403.2 J400.6(SHIELD1) J400.7(SHIELD2) J400.8(SHIELD3) J400.9(SHIELD4) R421.2
STATUS_LED_CTRL: Q400.5(G1) R412.2 U400.F1(PX19__/_PX59)
TARGET_RESET: R400.2 ; port EDBG_JTAG.TARGET_RESET
TARGET_RESET_: R400.1 U400.B4(PA29)
TARGET_RESET_SENSE: U400.H2(PX21) ; port TARGET_RESET_SENSE
XIN0: C400.1 U400.A5(PC02) XC400.1
XOUT0: C401.1 U400.A6(PC03) XC400.3
NetC402_1: C402.1 R420.2 U400.C7(USB_VBIAS)
NetC404_1: C404.1 L401.2 U400.J6(VDDANA)
NetC405_1: C405.1 C406.1 U400.E10(VDDCORE)
NetC407_1: C407.1 D402.4(VCC) J400.1(VBUS) L400.1
NetD400_1: D400.1(CATHODE) R409.2
NetD401_1: D401.1(CATHODE) R410.2
NetQ400_3: Q400.3(D1) R410.1
NetQ400_6: Q400.6(D2) R409.1

Not connected (* = marked no-connect by the designer): J400 4(ID)*; U400 A2(PA27)* A3(PB04) A4(PA30)* A7(PC05)* B1(PB00)* B2(PB01)* B7(PC04)* C1(PB11)* C2(PA31)* C4(PB03)* D1(PX12)* D2(PX10)* D4(PX16_/_PX53)* D7(PB06) E1(PA02_/_PX47)* E3(PX08)* E4(PX09)* E7(PA16)* E8(PA06_/_PA13)* F3(PX06)* F4(PX07)* G1(PX05)* G2(PX01)* G3(PX02)* G4(PX00)* G6(PA23_/_PX46)* G8(PA00_/_PA18)* G9(PA05)* G10(PA01_/_PA17)* H1(PX04)* H4(PX25)* H5(PX31)* H6(PA22_/_PX20)* H10(PA07_/_PA19)* J1(PX03)* J2(PX24)* J3(PX26)* J7(PA15_/_PX45)* J10(PA24_/_PX17)* K1(PX23)* K5(PC00_/_PX14)* K6(PC01)* K7(PA14_/_PX11)*; XC400 2* 4*

### Layout directives
differential pair; rule Assembly Testpoint Usage [Testpoint - Not Allowed    Multiple - Not Allowed]: EDBG_USB_FS_N, EDBG_USB_FS_P, EDBG_USB_HS_N, EDBG_USB_HS_P
rule Assembly Testpoint Usage [Testpoint - Not Allowed    Multiple - Not Allowed]: XIN0, XOUT0

### Notes on the sheet
- (near TP400) Connect the test points during startup of the EDBG to force it into bootloader mode.
  The test points should be covered with solder so that it is easier to get a good contact.
- (near R417) Current limiter, 10mA @3.3V
- Input filter on USB power input.
- Programming interface of the embedded debugger. The test points will be connected by needles in the test fixture for programming. GND test point is TP400.
- Date:
- PAGE:
- of
- TITLE:
- Document number:
- Revision:

### Library data of the parts
C400 C401 = A01-0019: Ceramic capacitor, SMD 0402, NP0, 50V, +/-5%; PartGroup: Capacitors,Ceramic,SMD 0402; TemperatureRange: -55 - +125 deg C; AN: A01-0019; Tolerance: 50V, +/-5%; Height: 0,550000011920929
C402 = A01-0015: as C207 on sheet ATmega324PB_Xplained_Pro_Target_MCU; AN: A01-0015; Tolerance: 50V, +/-5%; Height: 0,550000011920929
C403 = A01-0046: Ceramic capacitor, SMD 0402, X7R, 25V, +/-10%; PartGroup: Capacitors,Ceramic,SMD 0402; TemperatureRange: -55 - +125 deg C; AN: A01-0046; Tolerance: 25V, +/-10%; Height: 0,550000011920929
C404 C410-C413 = A01-0246: as C200 on sheet ATmega324PB_Xplained_Pro_Target_MCU; AN: A01-0246; Tolerance: 16V, +/-10%; Height: 0,5
C405 C409 C414 C415 = A01-0300: Ceramic capacitor, SMD 0402, X5R, 6.3V, +/-20%; PartGroup: Capacitors,Ceramic,SMD 0402; Manufacturer: Kemet; MPN: C0402C225M9PAC; Tolerance: Â±20%; TemperatureRange: -55Â°C to +85Â°C; AN: A01-0300; Height: 0,5
C406-C408 = A01-0321: Ceramic capacitor, SMD 0402, C0G, 50V, +/-5%; PartGroup: Capacitors,Ceramic,SMD 0402; Manufacturer: Murata; MPN: GRM1555C1H102JA01D; Tolerance: 5%; AN: A01-0321; Height: 0,550000011920929
D400 = A10-0018: LED, Green, Wave length=575nm, SMD 0805, ±70°; PartGroup: Opto,LEDs,SMD; Manufacturer: Everlight; TemperatureRange: -40 - +85 deg C; AN: A10-0018; Height: 1,10000002384186; MPN: EL17-21SYGC
D401 = A10-0019: as D200 on sheet ATmega324PB_Xplained_Pro_Target_MCU; AN: A10-0019; Height: 1,10000002384186
D402 = A06-0236: Double rail-to-rail USB ESD protection diode; OrcadPartType: Integrated Circuits&Special function&Protection; Manufacturer: NXP; PartGroup: Integrated Circuits,Special function,Protection; TemperatureRange: -40 to +85 C; AN: A06-0236; PartType: Buy; Height: 1,10000002384186; MPN: PRTR5V0U2X
J400 = A08-2112: Micro USB AB Connector, Standard SMT + DIP; PartGroup: Mechanical devices,Connectors,USB; Manufacturer: HIROSE; AN: A08-2112; Height: 2,79999995231628; MPN: ZX62D-AB-5P8
L400 L401 = A03-0035: as L200 on sheet ATmega324PB_Xplained_Pro_Target_MCU; AN: A03-0035; Height: 0,800000011920929; MPN: BLM18PG471SN1
Q400 = A05-0051: Dual N-Channel MOSFET, 60V, 115mA cont,RDS(ON) < 7.5 Ohm @50mA@5V, SOT-363; PartGroup: Transistors,Small signal FET,SMD; Manufacturer: Fairchild; TemperatureRange: -65 to 150 deg C; AN: A05-0051; Height: 1,10000002384186; MPN: 2N7002DW
R400-R404 R409-R411 R413-R417 = A02-0200: as R214 on sheet ATmega324PB_Xplained_Pro_Target_MCU; AN: A02-0200; Tolerance: 1 %; Height: 0,349999994039536
R405-R407 = A02-0212: Thick film resistor, SMD 0402, 1/16W, 1%; PartGroup: Resistors,SMD,0402 1%; TemperatureRange: -55 - +125 deg C; AN: A02-0212; Tolerance: 1 %; Height: 0,349999994039536
R408 R412 R421 = A02-0284: Thick film resistor, SMD 0402, 1/16W, 1%; PartGroup: Resistors,SMD,0402 1%; TemperatureRange: -55 - +125 deg C; AN: A02-0284; Tolerance: 1 %; Height: 0,349999994039536
R418 R419 = A02-0178: as R210 on sheet ATmega324PB_Xplained_Pro_Target_MCU; AN: A02-0178; Tolerance: 1 %; Height: 0,349999994039536
R420 = A02-0539: Thick film resistor, SMD 0402, 1/16W, 1%; PartGroup: Resistors,SMD,0402 1%; TemperatureRange: -55 - +125 deg C; AN: A02-0539; Tolerance: 1%; Height: 0,349999994039536
R422 = A02-0163: Thick film resistor, SMD 0402, 1/16W, 1%; PartGroup: Resistors,SMD,0402 1%; Manufacturer: (n/a); MPN: RMCF0402ZT0R00; TemperatureRange: -55 - +125 deg C; AN: A02-0163; Tolerance: 1 %; Height: 0,349999994039536
TP400-TP407 = A08-0004: as TP200 on sheet ATmega324PB_Xplained_Pro_Target_MCU; AN: A08-0004; Value: TESTPAD; Height: 0
U400 = A06-0736: AVR 32-bit RISC MCU; PartGroup: Integrated Circuits,MCU, MPU, DSP,AVR MCU; Manufacturer: ATMEL; TemperatureRange: -40 to +85 deg C; AN: A06-0736; Height: 1; MPN: AT32UC3A4256J-C1UR
XC400 = A07-0042: Fox FQ5032B 12.0MHz SMD crystal 738B-12; PartGroup: Frequency devices,Crystals,SMD; Manufacturer: Fox  Electronics; MPN: FQ5032B-12.000; Tolerance: Â±30ppm; TemperatureRange: 0Â°C ~ 70Â°C; AN: A07-0042; Height: 1,20000004768372

## Sheet ATmega324PB_Xplained_Pro_Connectors.SchDoc: Extension connectors
size A3; Organization: ATMEL Norway; Address1: Vestre Rosten 79; Address2: N-7075 TILLER; Address3: NORWAY; DocumentNumber: A09-2589; Revision: 2; SheetNumber: 4; SheetTotal: 5; PageSetup: Record=PageOptions|CenterHorizontal=True|CenterVertical=True|PrintScale=1.01|XCorrection=1.00|YCorrection=1.00|PrintKind=1|BorderSize=5000000|LeftOffset=0|BottomOffset=0|Orientation=2|PaperLength=1000|PaperWidth=1000|Scale=100|PaperSource=7|PrintQuality=-4|MediaType=1|DitherType=10|PaperKind=A3 (297 x 420 mm)|PrintScaleMode=1
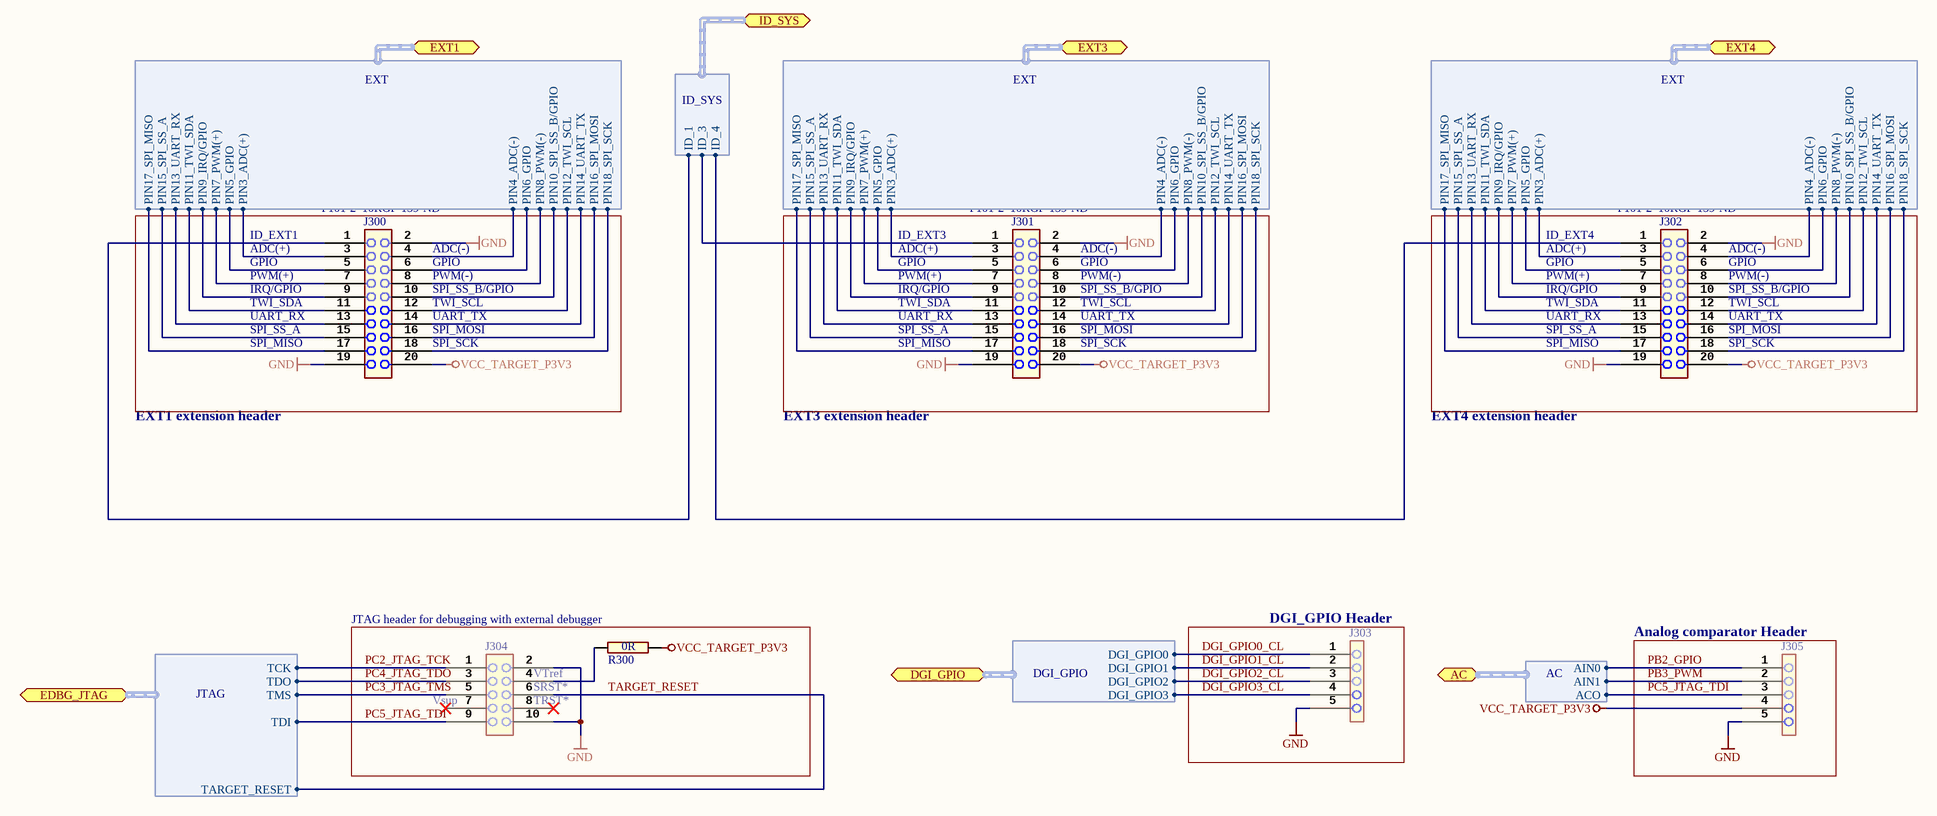
[diagram p3: ATmega324PB_Xplained_Pro_Connectors.SchDoc]

### Parts
J300  value P101-2*10RGF-139-ND  [AP8-00622]
J301  value P101-2*10RGF-139-ND  [AP8-00622]
J302  value P101-2*10RGF-139-ND  [AP8-00622]
J303  (no value)  [AP8-00968]
J304  (no value)  [AP8-00257]
J305  (no value)  [AP8-00968]
R300  value 0R  [AP2-00000]

### Blocks framed on the sheet
DGI_GPIO Header: J303
Analog comparator Header: J305

### Ports
AC (harness AC), DGI_GPIO (harness DGI_GPIO), EDBG_JTAG (harness JTAG), EXT1 (harness EXT), EXT3 (harness EXT), EXT4 (harness EXT), ID_SYS (harness ID_SYS)

### Harnesses
ID_SYS: ID_1, ID_3, ID_4
EXT: PIN3_ADC(+), PIN4_ADC(-), PIN5_GPIO, PIN6_GPIO, PIN7_PWM(+), PIN8_PWM(-), PIN9_IRQ/GPIO, PIN10_SPI_SS_B/GPIO, PIN11_TWI_SDA, PIN12_TWI_SCL, PIN13_UART_RX, PIN14_UART_TX, PIN15_SPI_SS_A, PIN16_SPI_MOSI, PIN17_SPI_MISO, PIN18_SPI_SCK
AC: AIN1, AIN0, ACO
JTAG: TCK, TDI, TDO, TMS, TARGET_RESET
DGI_GPIO: DGI_GPIO0, DGI_GPIO1, DGI_GPIO2, DGI_GPIO3

### Nets
GND: J300.2 J300.19 J301.2 J301.19 J302.2 J302.19 J303.5 J304.2 J304.10 J305.5
VCC_TARGET_P3V3: J300.20 J301.20 J302.20 J305.4 R300.2
DGI_GPIO0_CL: J303.1 ; port DGI_GPIO.DGI_GPIO0
DGI_GPIO1_CL: J303.2 ; port DGI_GPIO.DGI_GPIO1
DGI_GPIO2_CL: J303.3 ; port DGI_GPIO.DGI_GPIO2
DGI_GPIO3_CL: J303.4 ; port DGI_GPIO.DGI_GPIO3
ID1: J300.1 ; port ID_SYS.ID_1
ID3: J301.1 ; port ID_SYS.ID_3
ID4: J302.1 ; port ID_SYS.ID_4
PA0_ADC0: J300.3 ; port EXT1.PIN3_ADC(+)
PA1_ADC1: J300.4 ; port EXT1.PIN4_ADC(-)
PA2_GPIO: J300.5 ; port EXT1.PIN5_GPIO
PA3_GPIO: J300.6 ; port EXT1.PIN6_GPIO
PA4_ADC4: J302.3 ; port EXT4.PIN3_ADC(+)
PA5_ADC5: J302.4 ; port EXT4.PIN4_ADC(-)
PA6_GPIO: J302.5 ; port EXT4.PIN5_GPIO
PA7_GPIO: J302.6 ; port EXT4.PIN6_GPIO
PB0_GPIO: J302.15 ; port EXT4.PIN15_SPI_SS_A
PB1_GPIO: J301.10 ; port EXT3.PIN10_SPI_SS_B/GPIO
PB2_GPIO: J302.9 J305.1 ; port EXT4.PIN9_IRQ/GPIO, port AC.AIN0
PB3_PWM: J302.7 J305.2 ; port EXT4.PIN7_PWM(+), port AC.AIN1
PB4_SPI0_SS: J300.15 ; port EXT1.PIN15_SPI_SS_A
PB5_SPI0_MOSI: J300.16 J301.16 J302.16 ; port EXT1.PIN16_SPI_MOSI, port EXT3.PIN16_SPI_MOSI, port EXT4.PIN16_SPI_MOSI
PB6_SPI0_MISO: J300.17 J301.17 J302.17 ; port EXT1.PIN17_SPI_MISO, port EXT3.PIN17_SPI_MISO, port EXT4.PIN17_SPI_MISO
PB7_SPI0_SCK: J300.18 J301.18 J302.18 ; port EXT1.PIN18_SPI_SCK, port EXT3.PIN18_SPI_SCK, port EXT4.PIN18_SPI_SCK
PC0_GPIO: J300.10 ; port EXT1.PIN10_SPI_SS_B/GPIO
PC1_GPIO: J300.9 ; port EXT1.PIN9_IRQ/GPIO
PC2_GPIO: J301.6 ; port EXT3.PIN6_GPIO
PC2_JTAG_TCK: J304.1 ; port EDBG_JTAG.TCK
PC3_JTAG_TMS: J304.5 ; port EDBG_JTAG.TMS
PC3_TC4_ICP: J301.8 ; port EXT3.PIN8_PWM(-)
PC4_JTAG_TDO: J304.3 ; port EDBG_JTAG.TDO
PC4_TC4_OCA: J301.7 ; port EXT3.PIN7_PWM(+)
PC5_GPIO: J301.3 ; port EXT3.PIN3_ADC(+)
PC5_JTAG_TDI: J304.9 J305.3 ; port AC.ACO, port EDBG_JTAG.TDI
PC6_GPIO: J301.9 ; port EXT3.PIN9_IRQ/GPIO
PC7_GPIO: J301.4 ; port EXT3.PIN4_ADC(-)
PD0_RXD0: J300.13 ; port EXT1.PIN13_UART_RX
PD1_TXD0: J300.14 ; port EXT1.PIN14_UART_TX
PD2_RXD1: J301.13 ; port EXT3.PIN13_UART_RX
PD3_TXD1: J301.14 ; port EXT3.PIN14_UART_TX
PD4_TC1_OCB: J300.8 ; port EXT1.PIN8_PWM(-)
PD5_TC1_OCA: J300.7 ; port EXT1.PIN7_PWM(+)
PD6_SPI1_SS: J301.15 ; port EXT3.PIN15_SPI_SS_A
PD7_GPIO_SS: J302.10 ; port EXT4.PIN10_SPI_SS_B/GPIO
PE2_RXD2: J302.13 ; port EXT4.PIN13_UART_RX
PE3_TXD2: J302.14 ; port EXT4.PIN14_UART_TX
PE4_PWM: J301.5 J302.8 ; port EXT3.PIN5_GPIO, port EXT4.PIN8_PWM(-)
PE5_TW1_SDA: J300.11 J301.11 J302.11 ; port EXT1.PIN11_TWI_SDA, port EXT3.PIN11_TWI_SDA, port EXT4.PIN11_TWI_SDA
PE6_TW1_SCL: J300.12 J301.12 J302.12 ; port EXT1.PIN12_TWI_SCL, port EXT3.PIN12_TWI_SCL, port EXT4.PIN12_TWI_SCL
TARGET_RESET: J304.6 ; port EDBG_JTAG.TARGET_RESET
NetJ304_4: J304.4 R300.1

Not connected (* = marked no-connect by the designer): J304 7* 8*

### Notes on the sheet
- ID_EXT1
- ADC(+)
- (near J300) ADC(-)
- ID_EXT3
- (near J301) ADC(-)
- ID_EXT4
- (near J302) ADC(-)
- GPIO
- PWM(+)
- IRQ/GPIO
- TWI_SDA
- (near J300) GPIO
- (near J300) PWM(-)
- (near J300) SPI_SS_B/GPIO
- (near J300) TWI_SCL
- (near J301) GPIO
- (near J301) PWM(-)
- (near J301) SPI_SS_B/GPIO
- (near J301) TWI_SCL
- (near J302) GPIO
- (near J302) PWM(-)
- (near J302) SPI_SS_B/GPIO
- (near J302) TWI_SCL
- UART_RX
- SPI_SS_A
- SPI_MISO
- (near J300) UART_TX
- (near J300) SPI_MOSI
- (near J300) SPI_SCK
- (near J301) UART_TX
- (near J301) SPI_MOSI
- (near J301) SPI_SCK
- (near J302) UART_TX
- (near J302) SPI_MOSI
- (near J302) SPI_SCK
- EXT1 extension header
- EXT3 extension header
- EXT4 extension header
- (near R300) JTAG header for debugging with external debugger
- (near J304) Vsup
- (near J304) VTref
- (near J304) SRST*
- (near J304) TRST*
- Date:
- PAGE:
- of
- TITLE:
- Document number:
- Revision:

### Library data of the parts
J300-J302 = A08-1513: Pin header, 2x10, Right Angle, 2.54mm, THM, Pin In Paste; PartGroup: Mechanical devices,Connectors,Pin headers; Manufacturer: Pro-data International Corp; AN: A08-1513; MPN: P101-2*10RGF-139-ND
J303 J305 = A08-2448: 1x5 pin header, 2.54mm pitch, Pin-in-Paste THM; PartGroup: Mechanical devices,Connectors,Pin headers; Manufacturer: SAMTEC; Value: HMTSW-105-23-F-S-237; TemperatureRange: - 55 deg C to + 125 deg C; AN: A08-2448; Height: 6,09999990463257; MPN: HMTSW-105-23-F-S-237
J304 = A08-0385: 2x5 pin header, 1.27mm pitch, THM; PartGroup: Mechanical devices,Connectors,Pin headers; Manufacturer: Garry; MPN: 176-2-010-0-T-XS0-0730; Value: PIN HEADER 2x5; AN: A08-0385; Height: 7,30000019073486
R300 = A02-0163: as R202 on sheet ATmega324PB_Xplained_Pro_Target_MCU; AN: A02-0163; Height: 0,349999994039536

## Sheet ATmega324PB_Xplained_Pro_dual_input_power_supply.SchDoc: Power supply
size A3; Organization: ATMEL Norway; Address1: Vestre Rosten 79; Address2: N-7075 TILLER; Address3: NORWAY; DocumentNumber: A09-2419; Revision: 2; SheetNumber: 2; SheetTotal: 5; PageSetup: Record=PageOptions|CenterHorizontal=True|CenterVertical=True|PrintScale=1.01|XCorrection=1.00|YCorrection=1.00|PrintKind=1|BorderSize=5000000|LeftOffset=0|BottomOffset=0|Orientation=2|PaperLength=1000|PaperWidth=1000|Scale=100|PaperSource=7|PrintQuality=-4|MediaType=1|DitherType=10|PaperKind=A3 (297 x 420 mm)|PrintScaleMode=1
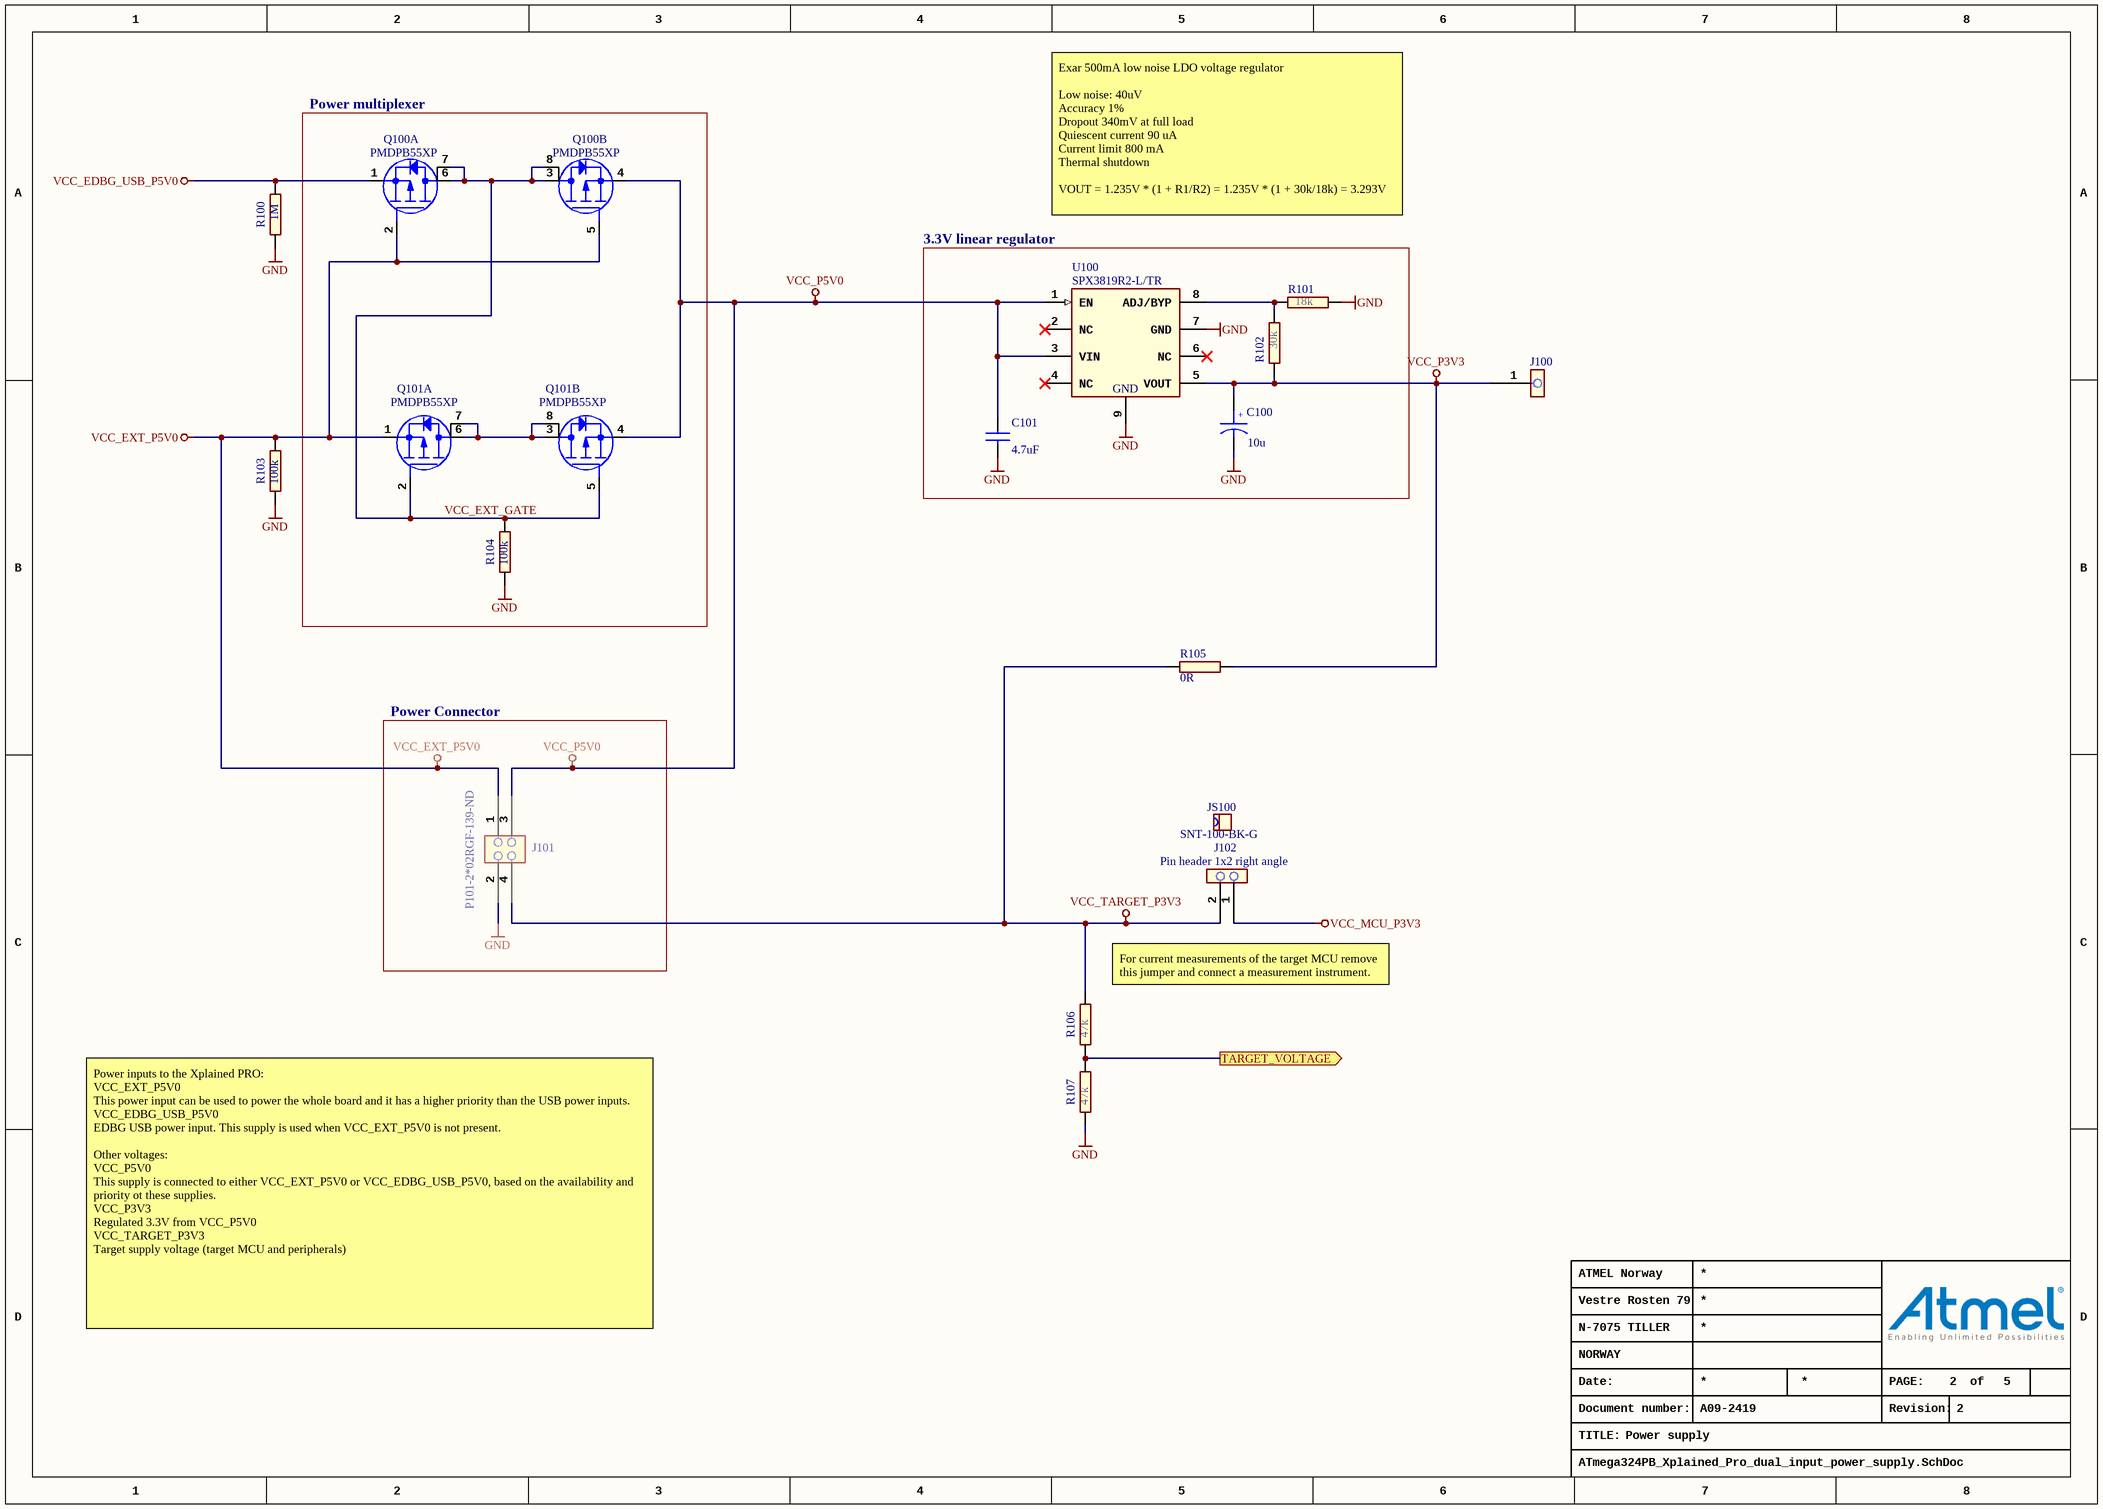
[diagram p4: ATmega324PB_Xplained_Pro_dual_input_power_supply.SchDoc]

### Parts
C100  value 10u  [AP1-00036]
C101  value 4.7uF  [AP1-00039]
J100  (no value)  [AP8-00976]
J101  value P101-2*02RGF-139-ND  [AP8-00628]
J102  value Pin header 1x2 right angle  [AP8-00367]
JS100  value SNT-100-BK-G  [AP8-00525]
Q100  value PMDPB55XP  [AP5-00047]  (hidden comment: Farnell order code: 2191806)  (parts A,B of 2)
Q101  value PMDPB55XP  [AP5-00047]  (hidden comment: Farnell order code: 2191806)  (parts A,B of 2)
R100  value 1M  [AP2-00000]
R101  value 18k  [AP2-00000]
R102  value 30k  [AP2-00000]
R103  value 100k  [AP2-00000]
R104  value 100k  [AP2-00000]
R105  value 0R  [AP2-00000]
R106  value 47k  [AP2-00000]
R107  value 47k  [AP2-00000]
U100  value SPX3819R2-L/TR  [AP6-00338]  (hidden comment: DigiKey: 1016-1588-2-ND)

### Blocks framed on the sheet
Power multiplexer: Q100 Q101 R104
3.3V linear regulator: C100 C101 R101 R102 U100
Power Connector: J101

### Ports
TARGET_VOLTAGE (out)

### Nets
GND: C100.2 C101.2 J101.2 R100.1 R101.2 R103.1 R104.1 R107.1 U100.7(GND) U100.9(GND)
VCC_EDBG_USB_P5V0: Q100.1(S1) R100.2
VCC_EXT_P5V0: J101.1 Q100.2(G1) Q100.5(G2) Q101.1(S1) R103.2
VCC_MCU_P3V3: J102.1
VCC_P3V3: C100.1 J100.1 R102.1 R105.2 U100.5(VOUT)
VCC_P5V0: C101.1 J101.3 Q100.4(S2) Q101.4(S2) U100.1(EN) U100.3(VIN)
VCC_TARGET_P3V3: J101.4 J102.2 R105.1 R106.2
EDBG_ADC0: R106.1 R107.2 ; port TARGET_VOLTAGE
VCC_EXT_GATE: Q100.3(D2) Q100.6(D1) Q100.7(D1_PAD) Q100.8(D2_PAD) Q101.2(G1) Q101.5(G2) R104.2
NetQ101_3: Q101.3(D2) Q101.6(D1) Q101.7(D1_PAD) Q101.8(D2_PAD)
NetR101_1: R101.1 R102.2 U100.8(ADJ/BYP)

Not connected (* = marked no-connect by the designer): U100 2(NC)* 4(NC)* 6(NC)*

### Notes on the sheet
- Exar 500mA low noise LDO voltage regulator
  Low noise: 40uV
  Accuracy 1%
  Dropout 340mV at full load
  Quiescent current 90 uA
  Current limit 800 mA
  Thermal shutdown
  VOUT = 1.235V * (1 + R1/R2) = 1.235V * (1 + 30k/18k) = 3.293V
- (near R106) For current measurements of the target MCU remove this jumper and connect a measurement instrument.
- Power inputs to the Xplained PRO:
  VCC_EXT_P5V0
  This power input can be used to power the whole board and it has a higher priority than the USB power inputs.
  VCC_EDBG_USB_P5V0
  EDBG USB power input. This supply is used when VCC_EXT_P5V0 is not present.
  Other voltages:
  VCC_P5V0
  This supply is connected to either VCC_EXT_P5V0 or VCC_EDBG_USB_P5V0, based on the availability and priority ot these supplies.
  VCC_P3V3
  Regulated 3.3V from VCC_P5V0
  VCC_TARGET_P3V3
  Target supply voltage (target MCU and peripherals)
- Date:
- PAGE:
- of
- TITLE:
- Document number:
- Revision:
- (in symbol A01-0324) +

### Library data of the parts
C100 = A01-0324: SMD tantalum capacitor, ESR = 1.7, 3216-18 (EIA) 1206,; PartGroup: Capacitors,Tantalum; Manufacturer: vishay; MPN: TR3A106K016C1700; Tolerance: +-10%; TemperatureRange: -55°C ~ 85°C; AN: A01-0324; Height: 1,60000002384186
C101 = A01-0377: as C203 on sheet ATmega324PB_Xplained_Pro_Target_MCU; AN: A01-0377; Tolerance: 10%; Height: 0,800000011920929
J100 = A08-2457: 1x1 pin header, 2.54mm pitch, Pin-in-Paste THM; PartGroup: Mechanical devices,Connectors,Pin headers; Manufacturer: SAMTEC; Value: HMTSW-101-23-F-S-237; TemperatureRange: - 55 deg C to + 125 deg C; AN: A08-2457; Height: 6,09999990463257; MPN: HMTSW-101-23-F-S-237
J101 = A08-1519: Pin header, 2x2, Right Angle, 2.54mm, THT, Pin In Paste; PartGroup: Mechanical devices,Connectors,Pin headers; Manufacturer: Pro-data International Corp; AN: A08-1519; Height: 5,07999992370605; MPN: P101-2*02RGF-139-ND
J102 = A08-0764: 1x2 pin header, right angle, 2.54 mm pitch, through-hole; PartGroup: Mechanical devices,Connectors,Pin headers; Manufacturer: Pro-data International Corp; MPN: 2213R-2G; AN: A08-0764; Height: 2,53999996185303
JS100 = A08-0543: as JS200 on sheet ATmega324PB_Xplained_Pro_Target_MCU; AN: A08-0543; MPN: SNT-100-BK-G
Q100 Q101 = A05-0146: Dual P-Channel MOSFET, -20V, RDS(ON) < 55 mOhm @-3.4A@-4.5V; PartGroup: Transistors,Power FET,SMD; Manufacturer: NXP; TemperatureRange: -55Â°C to 150Â°C; AN: A05-0146; Height: 0,649999976158142; MPN: PMDPB55XP
R100 = A02-0284: as R408 on sheet ATmega324PB_Xplained_Pro_EDBG; AN: A02-0284; Tolerance: 1 %; Height: 0,349999994039536
R101 = A02-0242: Thick film resistor, SMD 0402, 1/16W, 1%; PartGroup: Resistors,SMD,0402 1%; TemperatureRange: -55ï¿½ to +155ï¿½C; AN: A02-0242; Tolerance: 1 %; Height: 0,349999994039536
R102 = A02-0247: Thick film resistor, SMD 0402, 1/16W, 1%; PartGroup: Resistors,SMD,0402 1%; TemperatureRange: -55ï¿½ to +155ï¿½C; AN: A02-0247; Tolerance: 1 %; Height: 0,349999994039536
R103 R104 = A02-0260: as R208 on sheet ATmega324PB_Xplained_Pro_Target_MCU; AN: A02-0260; Tolerance: 1 %; Height: 0,349999994039536
R105 = A02-0163: as R202 on sheet ATmega324PB_Xplained_Pro_Target_MCU; AN: A02-0163; Height: 0,349999994039536
R106 R107 = A02-0252: Thick film resistor, SMD 0402, 1/16W, 1%; PartGroup: Resistors,SMD,0402 1%; TemperatureRange: -55 - +125 deg C; AN: A02-0252; Tolerance: 1 %; Height: 0,349999994039536
U100 = A06-0957: 500mA LDO, ADJ, low noise, 8-DFN package; PartGroup: Integrated Circuits,Regulators,Linear; Manufacturer: Exar; Tolerance: ±1%; TemperatureRange: -40°C to +125°C; AN: A06-0957; Height: 1; MPN: SPX3819R2-L/TR

## Nets that join several sheets
GND: ATmega324PB_Xplained_Pro_Target_MCU (22 pins), ATmega324PB_Xplained_Pro_EDBG (33 pins), ATmega324PB_Xplained_Pro_Connectors (10 pins), ATmega324PB_Xplained_Pro_dual_input_power_supply (10 pins)
VCC_EDBG_USB_P5V0: ATmega324PB_Xplained_Pro_EDBG (C408.1 L400.2 U400.A10), ATmega324PB_Xplained_Pro_dual_input_power_supply (Q100.1 R100.2)
VCC_MCU_P3V3: ATmega324PB_Xplained_Pro_Target_MCU (C203.1 C204.1 L200.2 U200.5), ATmega324PB_Xplained_Pro_dual_input_power_supply (J102.1)
VCC_P3V3: ATmega324PB_Xplained_Pro_EDBG (R422.2), ATmega324PB_Xplained_Pro_dual_input_power_supply (5 pins)
VCC_TARGET_P3V3: ATmega324PB_Xplained_Pro_Target_MCU (6 pins), ATmega324PB_Xplained_Pro_Connectors (5 pins), ATmega324PB_Xplained_Pro_dual_input_power_supply (J101.4 J102.2 R105.1 R106.2)
DGI_GPIO0_CL: ATmega324PB_Xplained_Pro_Target_MCU (R215.1), ATmega324PB_Xplained_Pro_EDBG (R413.1), ATmega324PB_Xplained_Pro_Connectors (J303.1)
DGI_GPIO1_CL: ATmega324PB_Xplained_Pro_Target_MCU (R216.1), ATmega324PB_Xplained_Pro_EDBG (R414.1), ATmega324PB_Xplained_Pro_Connectors (J303.2)
DGI_GPIO2_CL: ATmega324PB_Xplained_Pro_Target_MCU (R217.1), ATmega324PB_Xplained_Pro_EDBG (R415.1), ATmega324PB_Xplained_Pro_Connectors (J303.3)
DGI_GPIO3_CL: ATmega324PB_Xplained_Pro_Target_MCU (R218.1), ATmega324PB_Xplained_Pro_EDBG (R416.1), ATmega324PB_Xplained_Pro_Connectors (J303.4)
EDBG_ADC0: ATmega324PB_Xplained_Pro_EDBG (U400.K10), ATmega324PB_Xplained_Pro_dual_input_power_supply (R106.1 R107.2)
EDBG_CDC_USART_RX: ATmega324PB_Xplained_Pro_Target_MCU (R204.1), ATmega324PB_Xplained_Pro_EDBG (U400.F9)
EDBG_DGI_SCL: ATmega324PB_Xplained_Pro_Target_MCU (R203.1), ATmega324PB_Xplained_Pro_EDBG (U400.F7)
EDBG_DGI_SDA: ATmega324PB_Xplained_Pro_Target_MCU (R202.1), ATmega324PB_Xplained_Pro_EDBG (U400.G7)
EDBG_SPI_DGI_MOSI: ATmega324PB_Xplained_Pro_Target_MCU (R205.1), ATmega324PB_Xplained_Pro_EDBG (U400.K3)
EDBG_SPI_DGI_SCK: ATmega324PB_Xplained_Pro_Target_MCU (R206.1), ATmega324PB_Xplained_Pro_EDBG (U400.J4)
EDBG_SPI_DGI_SS: ATmega324PB_Xplained_Pro_Target_MCU (R207.1), ATmega324PB_Xplained_Pro_EDBG (U400.G5)
ID1: ATmega324PB_Xplained_Pro_EDBG (R407.1 U400.A1), ATmega324PB_Xplained_Pro_Connectors (J300.1)
ID3: ATmega324PB_Xplained_Pro_EDBG (R406.1 U400.B3), ATmega324PB_Xplained_Pro_Connectors (J301.1)
ID4: ATmega324PB_Xplained_Pro_EDBG (R405.1 U400.D3), ATmega324PB_Xplained_Pro_Connectors (J302.1)
PA0_ADC0: ATmega324PB_Xplained_Pro_Target_MCU (U200.37), ATmega324PB_Xplained_Pro_Connectors (J300.3)
PA1_ADC1: ATmega324PB_Xplained_Pro_Target_MCU (U200.36), ATmega324PB_Xplained_Pro_Connectors (J300.4)
PA2_GPIO: ATmega324PB_Xplained_Pro_Target_MCU (U200.35), ATmega324PB_Xplained_Pro_Connectors (J300.5)
PA3_GPIO: ATmega324PB_Xplained_Pro_Target_MCU (U200.34), ATmega324PB_Xplained_Pro_Connectors (J300.6)
PA4_ADC4: ATmega324PB_Xplained_Pro_Target_MCU (U200.33), ATmega324PB_Xplained_Pro_Connectors (J302.3)
PA5_ADC5: ATmega324PB_Xplained_Pro_Target_MCU (U200.32), ATmega324PB_Xplained_Pro_Connectors (J302.4)
PA6_GPIO: ATmega324PB_Xplained_Pro_Target_MCU (U200.31), ATmega324PB_Xplained_Pro_Connectors (J302.5)
PA7_GPIO: ATmega324PB_Xplained_Pro_Target_MCU (J201.2), ATmega324PB_Xplained_Pro_Connectors (J302.6)
PB0_GPIO: ATmega324PB_Xplained_Pro_Target_MCU (U200.40), ATmega324PB_Xplained_Pro_Connectors (J302.15)
PB1_GPIO: ATmega324PB_Xplained_Pro_Target_MCU (U200.41), ATmega324PB_Xplained_Pro_Connectors (J301.10)
PB2_GPIO: ATmega324PB_Xplained_Pro_Target_MCU (R216.2 U200.42), ATmega324PB_Xplained_Pro_Connectors (J302.9 J305.1)
PB3_PWM: ATmega324PB_Xplained_Pro_Target_MCU (U200.43), ATmega324PB_Xplained_Pro_Connectors (J302.7 J305.2)
PB4_SPI0_SS: ATmega324PB_Xplained_Pro_Target_MCU (R215.2 U200.44), ATmega324PB_Xplained_Pro_Connectors (J300.15)
PB5_SPI0_MOSI: ATmega324PB_Xplained_Pro_Target_MCU (R205.2 U200.1), ATmega324PB_Xplained_Pro_Connectors (J300.16 J301.16 J302.16)
PB6_SPI0_MISO: ATmega324PB_Xplained_Pro_Target_MCU (U200.2), ATmega324PB_Xplained_Pro_EDBG (R417.2), ATmega324PB_Xplained_Pro_Connectors (J300.17 J301.17 J302.17)
PB7_SPI0_SCK: ATmega324PB_Xplained_Pro_Target_MCU (R206.2 U200.3), ATmega324PB_Xplained_Pro_Connectors (J300.18 J301.18 J302.18)
PC0_GPIO: ATmega324PB_Xplained_Pro_Target_MCU (U200.19), ATmega324PB_Xplained_Pro_Connectors (J300.10)
PC1_GPIO: ATmega324PB_Xplained_Pro_Target_MCU (R217.2 U200.20), ATmega324PB_Xplained_Pro_Connectors (J300.9)
PC2_GPIO: ATmega324PB_Xplained_Pro_Target_MCU (J200.4), ATmega324PB_Xplained_Pro_Connectors (J301.6)
PC2_JTAG_TCK: ATmega324PB_Xplained_Pro_Target_MCU (J200.3 U200.21), ATmega324PB_Xplained_Pro_EDBG (R401.2), ATmega324PB_Xplained_Pro_Connectors (J304.1)
PC3_JTAG_TMS: ATmega324PB_Xplained_Pro_Target_MCU (J200.7 U200.22), ATmega324PB_Xplained_Pro_EDBG (R403.2), ATmega324PB_Xplained_Pro_Connectors (J304.5)
PC3_TC4_ICP: ATmega324PB_Xplained_Pro_Target_MCU (J200.8), ATmega324PB_Xplained_Pro_Connectors (J301.8)
PC4_JTAG_TDO: ATmega324PB_Xplained_Pro_Target_MCU (J200.5 U200.23), ATmega324PB_Xplained_Pro_EDBG (R402.2), ATmega324PB_Xplained_Pro_Connectors (J304.3)
PC4_TC4_OCA: ATmega324PB_Xplained_Pro_Target_MCU (J200.6), ATmega324PB_Xplained_Pro_Connectors (J301.7)
PC5_GPIO: ATmega324PB_Xplained_Pro_Target_MCU (J200.2), ATmega324PB_Xplained_Pro_Connectors (J301.3)
PC5_JTAG_TDI: ATmega324PB_Xplained_Pro_Target_MCU (J200.1 U200.24), ATmega324PB_Xplained_Pro_EDBG (R404.2), ATmega324PB_Xplained_Pro_Connectors (J304.9 J305.3)
PC6_GPIO: ATmega324PB_Xplained_Pro_Target_MCU (R211.2 R213.2 R218.2), ATmega324PB_Xplained_Pro_Connectors (J301.9)
PC7_GPIO: ATmega324PB_Xplained_Pro_Target_MCU (D200.1 R212.2), ATmega324PB_Xplained_Pro_Connectors (J301.4)
PD0_RXD0: ATmega324PB_Xplained_Pro_Target_MCU (U200.9), ATmega324PB_Xplained_Pro_Connectors (J300.13)
PD1_TXD0: ATmega324PB_Xplained_Pro_Target_MCU (U200.10), ATmega324PB_Xplained_Pro_Connectors (J300.14)
PD2_RXD1: ATmega324PB_Xplained_Pro_Target_MCU (U200.11), ATmega324PB_Xplained_Pro_EDBG (R411.1), ATmega324PB_Xplained_Pro_Connectors (J301.13)
PD3_TXD1: ATmega324PB_Xplained_Pro_Target_MCU (R204.2 U200.12), ATmega324PB_Xplained_Pro_Connectors (J301.14)
PD4_TC1_OCB: ATmega324PB_Xplained_Pro_Target_MCU (U200.13), ATmega324PB_Xplained_Pro_Connectors (J300.8)
PD5_TC1_OCA: ATmega324PB_Xplained_Pro_Target_MCU (U200.14), ATmega324PB_Xplained_Pro_Connectors (J300.7)
PD6_SPI1_SS: ATmega324PB_Xplained_Pro_Target_MCU (U200.15), ATmega324PB_Xplained_Pro_Connectors (J301.15)
PD7_GPIO_SS: ATmega324PB_Xplained_Pro_Target_MCU (U200.16), ATmega324PB_Xplained_Pro_Connectors (J302.10)
PE2_RXD2: ATmega324PB_Xplained_Pro_Target_MCU (U200.17), ATmega324PB_Xplained_Pro_Connectors (J302.13)
PE3_TXD2: ATmega324PB_Xplained_Pro_Target_MCU (U200.18), ATmega324PB_Xplained_Pro_Connectors (J302.14)
PE4_PWM: ATmega324PB_Xplained_Pro_Target_MCU (C200.2 U200.29), ATmega324PB_Xplained_Pro_Connectors (J301.5 J302.8)
PE5_TW1_SDA: ATmega324PB_Xplained_Pro_Target_MCU (R201.1 R202.2 U200.38 U201.5), ATmega324PB_Xplained_Pro_Connectors (J300.11 J301.11 J302.11)
PE6_TW1_SCL: ATmega324PB_Xplained_Pro_Target_MCU (R200.1 R203.2 U200.39 U201.6), ATmega324PB_Xplained_Pro_Connectors (J300.12 J301.12 J302.12)
TARGET_RESET: ATmega324PB_Xplained_Pro_Target_MCU (5 pins), ATmega324PB_Xplained_Pro_EDBG (R400.2), ATmega324PB_Xplained_Pro_Connectors (J304.6)
TARGET_RESET_SENSE: ATmega324PB_Xplained_Pro_Target_MCU (R209.1), ATmega324PB_Xplained_Pro_EDBG (U400.H2)